# EAGLE design quanton rev.1 (EAGLE 6.4)

## Sheet 1 of 4
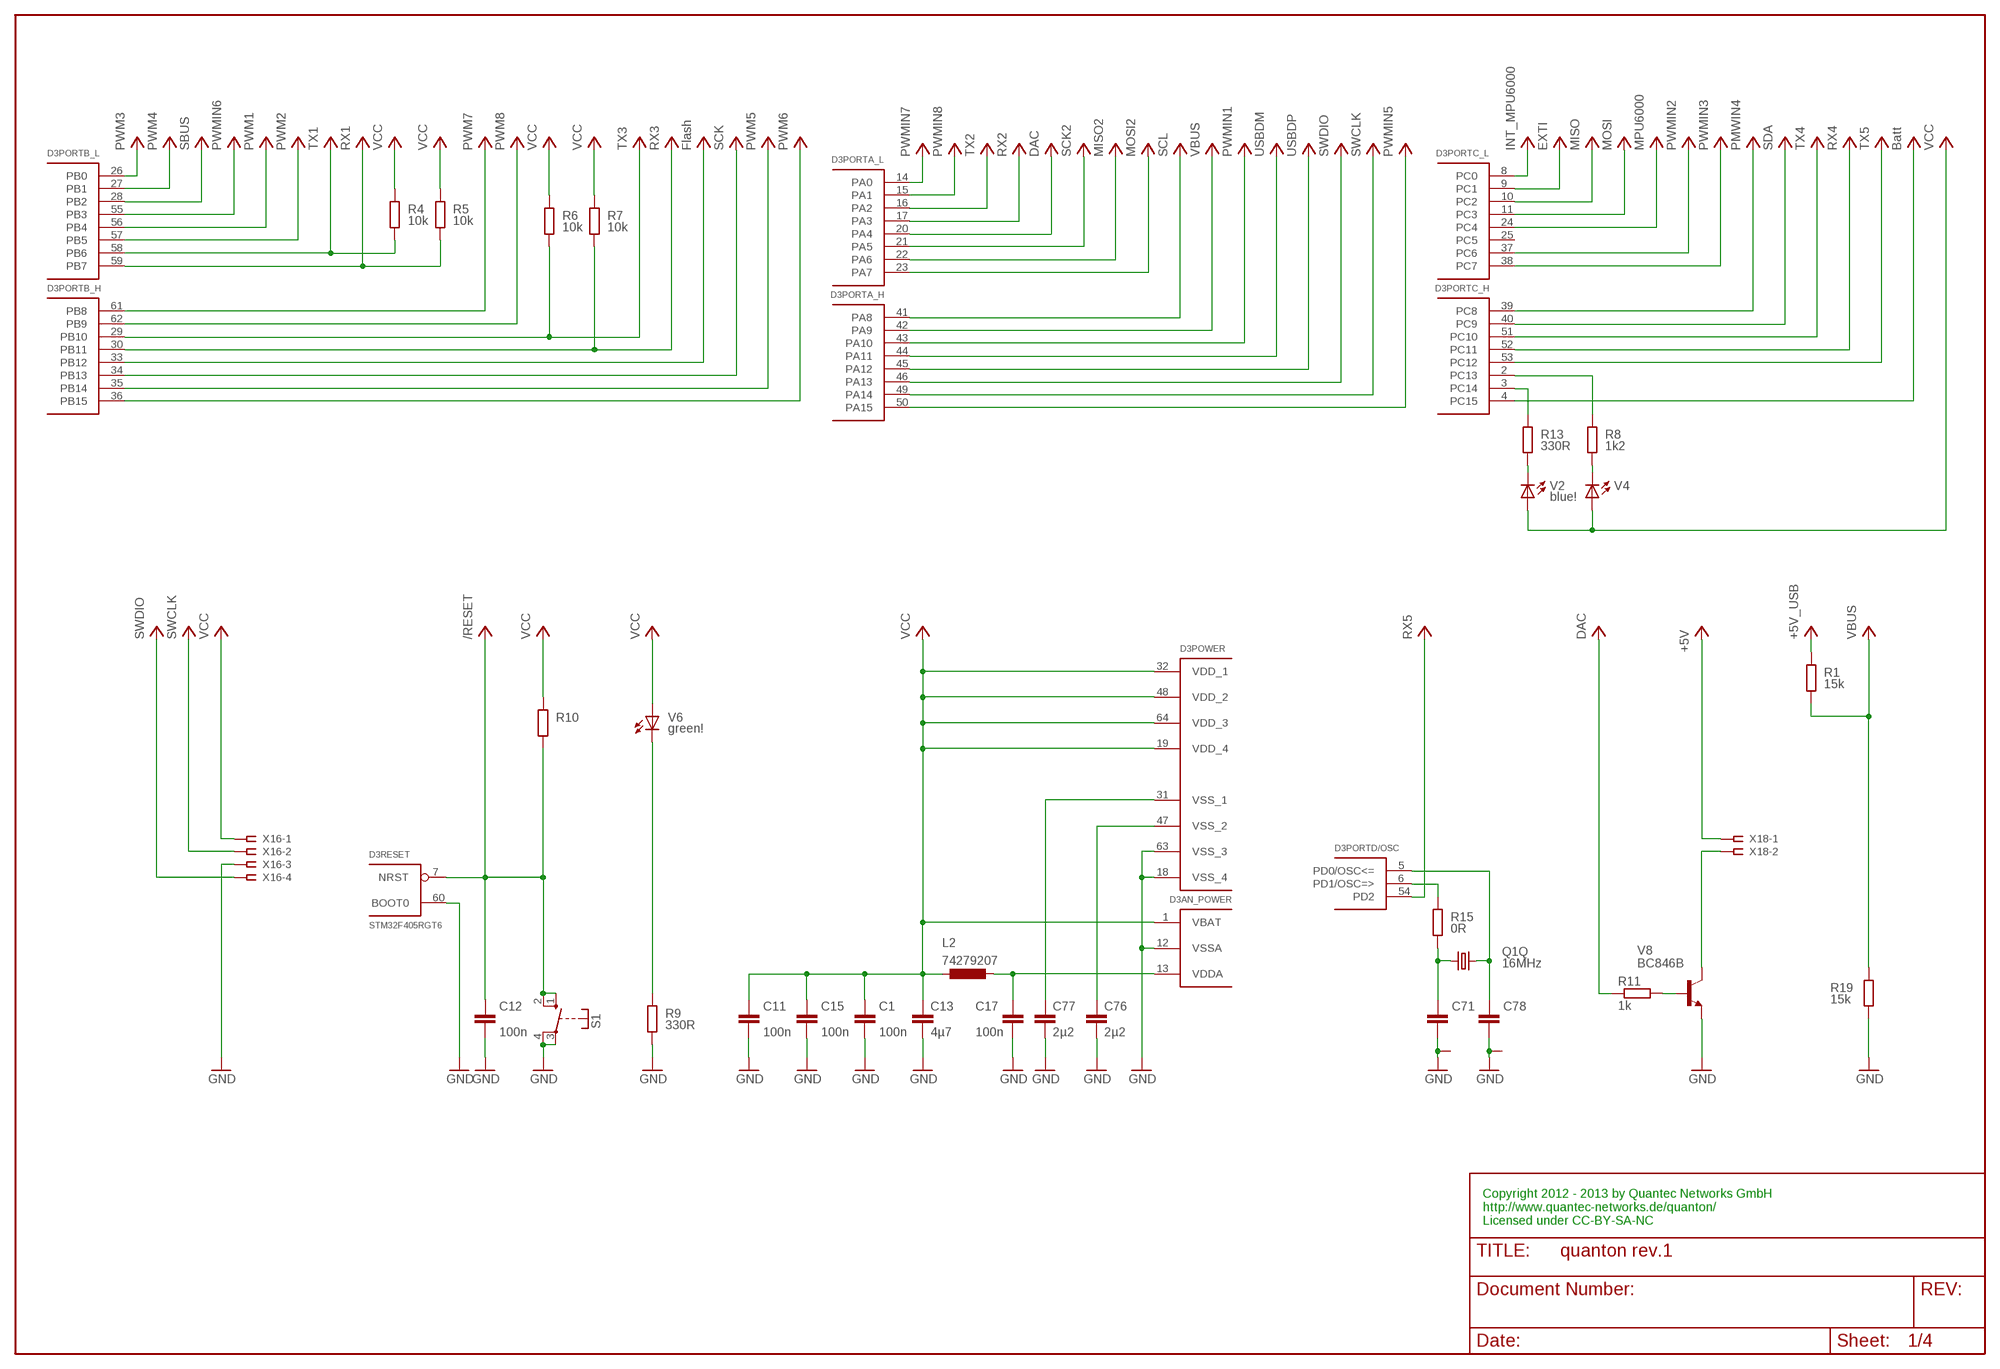
[diagram p0: schematic, sheet 1]

### Parts
C1  100n  C-EUC0402  [C0402]
C11  100n  C-EUC0402  [C0402]
C12  100n  C-EUC0402  [C0402]
C13  4µ7  C-EUC0805  [C0805]
C15  100n  C-EUC0402  [C0402]
C17  100n  C-EUC0402  [C0402]
C71  C-EUC0603  [C0603]
C76  2µ2  C-EUC0603  [C0603]
C77  2µ2  C-EUC0603  [C0603]
C78  C-EUC0603  [C0603]
D3  STM32F405RGT6  STM32F10XRXT6  [TQFP64]
L2  74279207  L-EU0805  [R0805]
Q1  16MHz  50X32  [50X32]
R1  15k  R-EU_R0603  [R0603]
R4  10k  R-EU_R0603  [R0603]
R5  10k  R-EU_R0603  [R0603]
R6  10k  R-EU_R0603  [R0603]
R7  10k  R-EU_R0603  [R0603]
R8  1k2  R-EU_R0603  [R0603]
R9  330R  R-EU_R0603  [R0603]
R10  R-EU_R0603  [R0603]
R11  1k  R-EU_R0603  [R0603]
R13  330R  R-EU_R0603  [R0603]
R15  0R  R-EU_R0603  [R0603]
R19  15k  R-EU_R0603  [R0603]
S1  KSCXXXX  [KSCXXXJ]
V2  blue!  LEDCHIP-LED0805  [CHIP-LED0805]
V4  red!  LEDCHIP-LED0805  [CHIP-LED0805]
V6  green!  LEDCHIP-LED0805  [CHIP-LED0805]
V8  BC846B  BC846BSMD  [SOT23]
X16  SSW-104-02-S-S  [SSW-104-02-S-S]
X18  SSW-101-02-S-D  [SSW-101-02-S-D]

### Nets
+5V: X18.1 ; also sheet 2,3
+5V_USB: R1.2 ; also sheet 3
/RESET: C12.1 D3.7(RESET:NRST) R10.1 S1.1(S) S1.2(S)
BATT: D3.4(PORTC_H:PC15) ; supply symbol labelled Batt ; also sheet 3
DAC: D3.20(PORTA_L:PA4) R11.1
EXTI: D3.9(PORTC_L:PC1) ; also sheet 4
FLASH: D3.33(PORTB_H:PB12) ; supply symbol labelled Flash ; also sheet 3
GND: C1.2 C11.2 C12.2 C13.2 C15.2 C17.2 C71.2 C76.2 C77.2 C78.2 D3.12(AN_POWER:VSSA) D3.18(POWER:VSS_4) D3.60(RESET:BOOT0) D3.63(POWER:VSS_3) Q1.2(GND1:GND) Q1.4(GND2:GND) R9.1 R19.1 S1.3(P) S1.4(P) V8.2(E) X16.3 ; also sheet 2,3,4
HL: C76.1 D3.47(POWER:VSS_2)
IIUPO: C77.1 D3.31(POWER:VSS_1)
INT_MPU6000: D3.8(PORTC_L:PC0) ; also sheet 3
MISO: D3.10(PORTC_L:PC2) ; also sheet 3
MISO2: D3.22(PORTA_L:PA6) ; also sheet 3
MOSI: D3.11(PORTC_L:PC3) ; also sheet 3
MOSI2: D3.23(PORTA_L:PA7) ; also sheet 3
MPU6000: D3.24(PORTC_L:PC4) ; also sheet 3
N$2: D3.3(PORTC_H:PC14) R13.2
N$3: C17.1 D3.13(AN_POWER:VDDA) L2.1
N$8: C78.1 D3.5(PORTD/OSC:PD0/OSC<=) Q1.3
N$11: R13.1 V2.C
N$20: R8.1 V4.C
N$21: D3.2(PORTC_H:PC13) R8.2
N$22: R9.2 V6.C
N$26: C71.1 Q1.1 R15.2
N$28: D3.6(PORTD/OSC:PD1/OSC=>) R15.1
N$44: V8.3(C) X18.2
N$45: R11.2 V8.1(B)
PMWIN4: D3.39(PORTC_H:PC8) ; also sheet 2
PWM1: D3.56(PORTB_L:PB4) ; also sheet 2
PWM2: D3.57(PORTB_L:PB5) ; also sheet 2
PWM3: D3.26(PORTB_L:PB0) ; also sheet 2
PWM4: D3.27(PORTB_L:PB1) ; also sheet 2
PWM5: D3.35(PORTB_H:PB14) ; also sheet 2
PWM6: D3.36(PORTB_H:PB15) ; also sheet 2
PWM7: D3.61(PORTB_H:PB8) ; also sheet 2
PWM8: D3.62(PORTB_H:PB9) ; also sheet 2
PWMIN1: D3.43(PORTA_H:PA10) ; also sheet 2
PWMIN2: D3.37(PORTC_L:PC6) ; also sheet 2
PWMIN3: D3.38(PORTC_L:PC7) ; also sheet 2
PWMIN5: D3.50(PORTA_H:PA15) ; also sheet 2
PWMIN6: D3.55(PORTB_L:PB3) ; also sheet 2
PWMIN7: D3.14(PORTA_L:PA0) ; also sheet 2
PWMIN8: D3.15(PORTA_L:PA1) ; also sheet 2
RX1: D3.59(PORTB_L:PB7) R5.1 ; also sheet 2
RX2: D3.17(PORTA_L:PA3) ; also sheet 2
RX3: D3.30(PORTB_H:PB11) R7.1 ; also sheet 2
RX4: D3.52(PORTC_H:PC11) ; also sheet 2
RX5: D3.54(PORTD/OSC:PD2) ; also sheet 2
SBUS: D3.28(PORTB_L:PB2) ; also sheet 2
SCK: D3.34(PORTB_H:PB13) ; also sheet 3
SCK2: D3.21(PORTA_L:PA5) ; also sheet 3
SCL: D3.41(PORTA_H:PA8) ; also sheet 4
SDA: D3.40(PORTC_H:PC9) ; also sheet 4
SWCLK: D3.49(PORTA_H:PA14) X16.2
SWDIO: D3.46(PORTA_H:PA13) X16.4
TX1: D3.58(PORTB_L:PB6) R4.1 ; also sheet 2
TX2: D3.16(PORTA_L:PA2) ; also sheet 2
TX3: D3.29(PORTB_H:PB10) R6.1 ; also sheet 2
TX4: D3.51(PORTC_H:PC10) ; also sheet 2
TX5: D3.53(PORTC_H:PC12) ; also sheet 2
USBDM: D3.44(PORTA_H:PA11) ; also sheet 3
USBDP: D3.45(PORTA_H:PA12) ; also sheet 3
VBUS: D3.42(PORTA_H:PA9) R1.1 R19.2
VCC: C1.1 C11.1 C13.1 C15.1 D3.1(AN_POWER:VBAT) D3.19(POWER:VDD_4) D3.32(POWER:VDD_1) D3.48(POWER:VDD_2) D3.64(POWER:VDD_3) L2.2 R4.2 R5.2 R6.2 R7.2 R10.2 V2.A V4.A V6.A X16.1 ; also sheet 2,3,4
Unconnected: D3.25(PORTC_L:PC5)

### Notes on the sheet
- Copyright 2012 - 2013 by Quantec Networks GmbH
  http://www.quantec-networks.de/quanton/
  Licensed under CC-BY-SA-NC

## Sheet 2 of 4
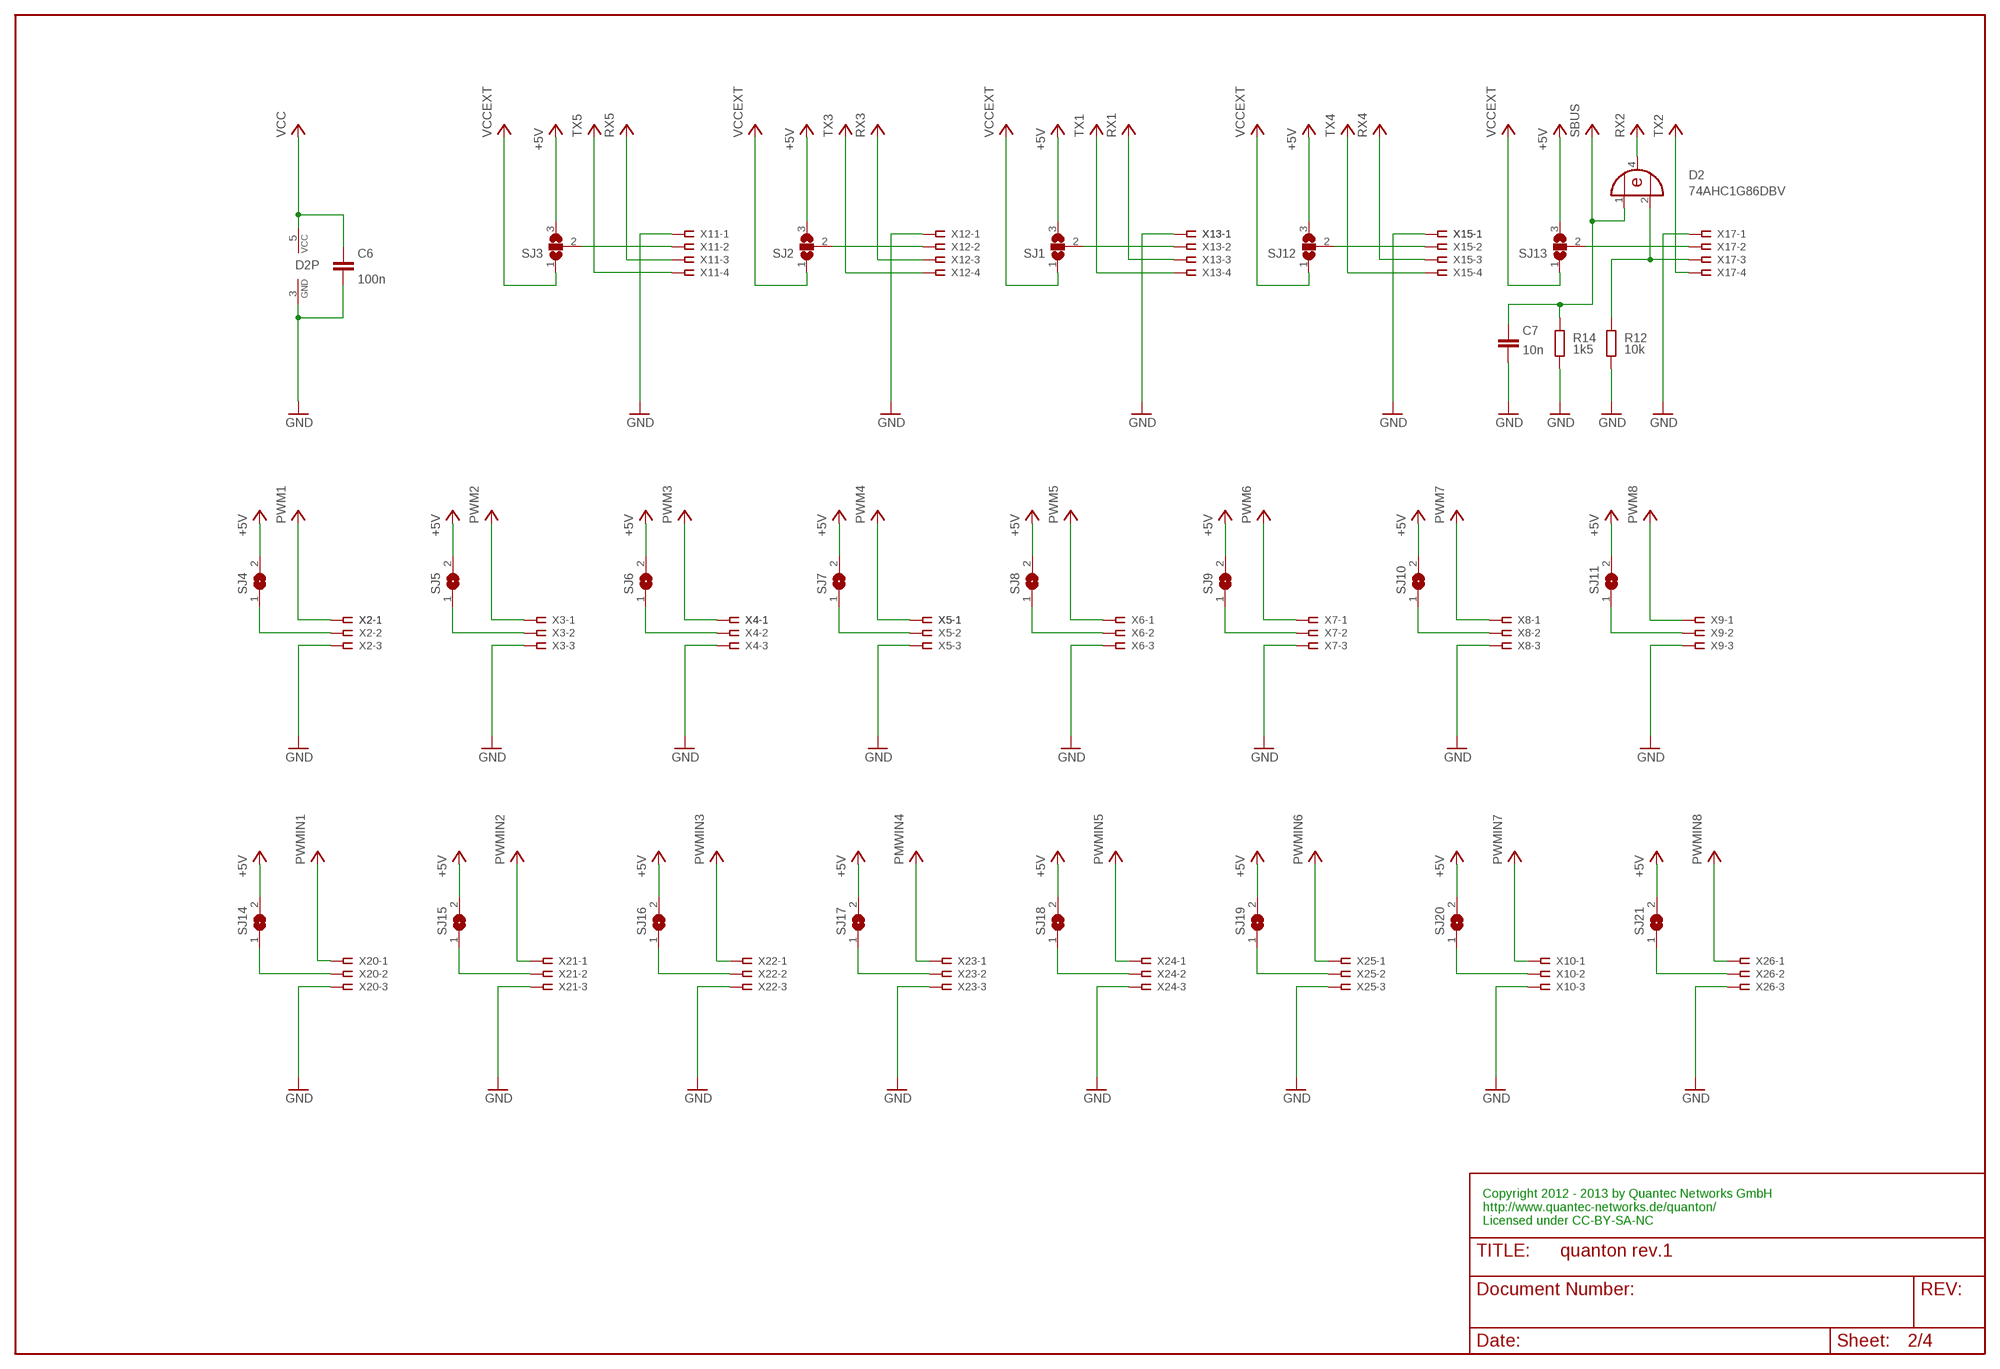
[diagram p1: schematic, sheet 2]

### Parts
C6  100n  C-EUC0402  [C0402]
C7  10n  C-EUC0603  [C0603]
D2  74AHC1G86DBV  [SOT23-5]
R12  10k  R-EU_R0603  [R0603]
R14  1k5  R-EU_R0603  [R0603]
SJ1  SJ2W  [SJ_2]
SJ2  SJ2W  [SJ_2]
SJ3  SJ2W  [SJ_2]
SJ4  SJ  [SJ]
SJ5  SJ  [SJ]
SJ6  SJ  [SJ]
SJ7  SJ  [SJ]
SJ8  SJ  [SJ]
SJ9  SJ  [SJ]
SJ10  SJ  [SJ]
SJ11  SJ  [SJ]
SJ12  SJ2W  [SJ_2]
SJ13  SJ2W  [SJ_2]
SJ14  SJ  [SJ]
SJ15  SJ  [SJ]
SJ16  SJ  [SJ]
SJ17  SJ  [SJ]
SJ18  SJ  [SJ]
SJ19  SJ  [SJ]
SJ20  SJ  [SJ]
SJ21  SJ  [SJ]
X2  SSW-101-02-S-T  [SSW-101-02-S-T]
X3  SSW-101-02-S-T  [SSW-101-02-S-T]
X4  SSW-101-02-S-T  [SSW-101-02-S-T]
X5  SSW-101-02-S-T  [SSW-101-02-S-T]
X6  SSW-101-02-S-T  [SSW-101-02-S-T]
X7  SSW-101-02-S-T  [SSW-101-02-S-T]
X8  SSW-101-02-S-T  [SSW-101-02-S-T]
X9  SSW-101-02-S-T  [SSW-101-02-S-T]
X10  SSW-101-02-S-T  [SSW-101-02-S-T]
X11  SSW-104-02-S-S  [SSW-104-02-S-S]
X12  SSW-104-02-S-S  [SSW-104-02-S-S]
X13  SSW-104-02-S-S  [SSW-104-02-S-S]
X15  SSW-104-02-S-S  [SSW-104-02-S-S]
X17  SSW-104-02-S-S  [SSW-104-02-S-S]
X20  SSW-101-02-S-T  [SSW-101-02-S-T]
X21  SSW-101-02-S-T  [SSW-101-02-S-T]
X22  SSW-101-02-S-T  [SSW-101-02-S-T]
X23  SSW-101-02-S-T  [SSW-101-02-S-T]
X24  SSW-101-02-S-T  [SSW-101-02-S-T]
X25  SSW-101-02-S-T  [SSW-101-02-S-T]
X26  SSW-101-02-S-T  [SSW-101-02-S-T]

### Nets
+5V: SJ1.3 SJ2.3 SJ3.3 SJ4.2 SJ5.2 SJ6.2 SJ7.2 SJ8.2 SJ9.2 SJ10.2 SJ11.2 SJ12.3 SJ13.3 SJ14.2 SJ15.2 SJ16.2 SJ17.2 SJ18.2 SJ19.2 SJ20.2 SJ21.2 ; also sheet 1,3
GND: C6.2 C7.2 D2.3(GND) R12.1 R14.1 X2.3 X3.3 X4.3 X5.3 X6.3 X7.3 X8.3 X9.3 X10.3 X11.1 X12.1 X13.1 X15.1 X17.1 X20.3 X21.3 X22.3 X23.3 X24.3 X25.3 X26.3 ; also sheet 1,3,4
N$1: SJ1.2 X13.2
N$5: SJ4.1 X2.2
N$6: SJ2.2 X12.2
N$7: SJ3.2 X11.2
N$9: SJ5.1 X3.2
N$10: SJ6.1 X4.2
N$12: SJ7.1 X5.2
N$13: SJ8.1 X6.2
N$14: SJ9.1 X7.2
N$15: SJ10.1 X8.2
N$16: SJ11.1 X9.2
N$23: SJ12.2 X15.2
N$24: SJ13.2 X17.2
N$25: D2.2(I1) R12.2 X17.3
N$29: SJ14.1 X20.2
N$30: SJ15.1 X21.2
N$31: SJ16.1 X22.2
N$32: SJ17.1 X23.2
N$33: SJ18.1 X24.2
N$34: SJ19.1 X25.2
N$35: SJ20.1 X10.2
N$36: SJ21.1 X26.2
PMWIN4: X23.1 ; also sheet 1
PWM1: X2.1 ; also sheet 1
PWM2: X3.1 ; also sheet 1
PWM3: X4.1 ; also sheet 1
PWM4: X5.1 ; also sheet 1
PWM5: X6.1 ; also sheet 1
PWM6: X7.1 ; also sheet 1
PWM7: X8.1 ; also sheet 1
PWM8: X9.1 ; also sheet 1
PWMIN1: X20.1 ; also sheet 1
PWMIN2: X21.1 ; also sheet 1
PWMIN3: X22.1 ; also sheet 1
PWMIN5: X24.1 ; also sheet 1
PWMIN6: X25.1 ; also sheet 1
PWMIN7: X10.1 ; also sheet 1
PWMIN8: X26.1 ; also sheet 1
RX1: X13.3 ; also sheet 1
RX2: D2.4(O) ; also sheet 1
RX3: X12.3 ; also sheet 1
RX4: X15.3 ; also sheet 1
RX5: X11.3 ; also sheet 1
SBUS: C7.1 D2.1(I0) R14.2 ; also sheet 1
TX1: X13.4 ; also sheet 1
TX2: X17.4 ; also sheet 1
TX3: X12.4 ; also sheet 1
TX4: X15.4 ; also sheet 1
TX5: X11.4 ; also sheet 1
VCC: C6.1 D2.5(VCC) ; also sheet 1,3,4
VCCEXT: SJ1.1 SJ2.1 SJ3.1 SJ12.1 SJ13.1 ; also sheet 3

### Notes on the sheet
- Copyright 2012 - 2013 by Quantec Networks GmbH
  http://www.quantec-networks.de/quanton/
  Licensed under CC-BY-SA-NC

## Sheet 3 of 4
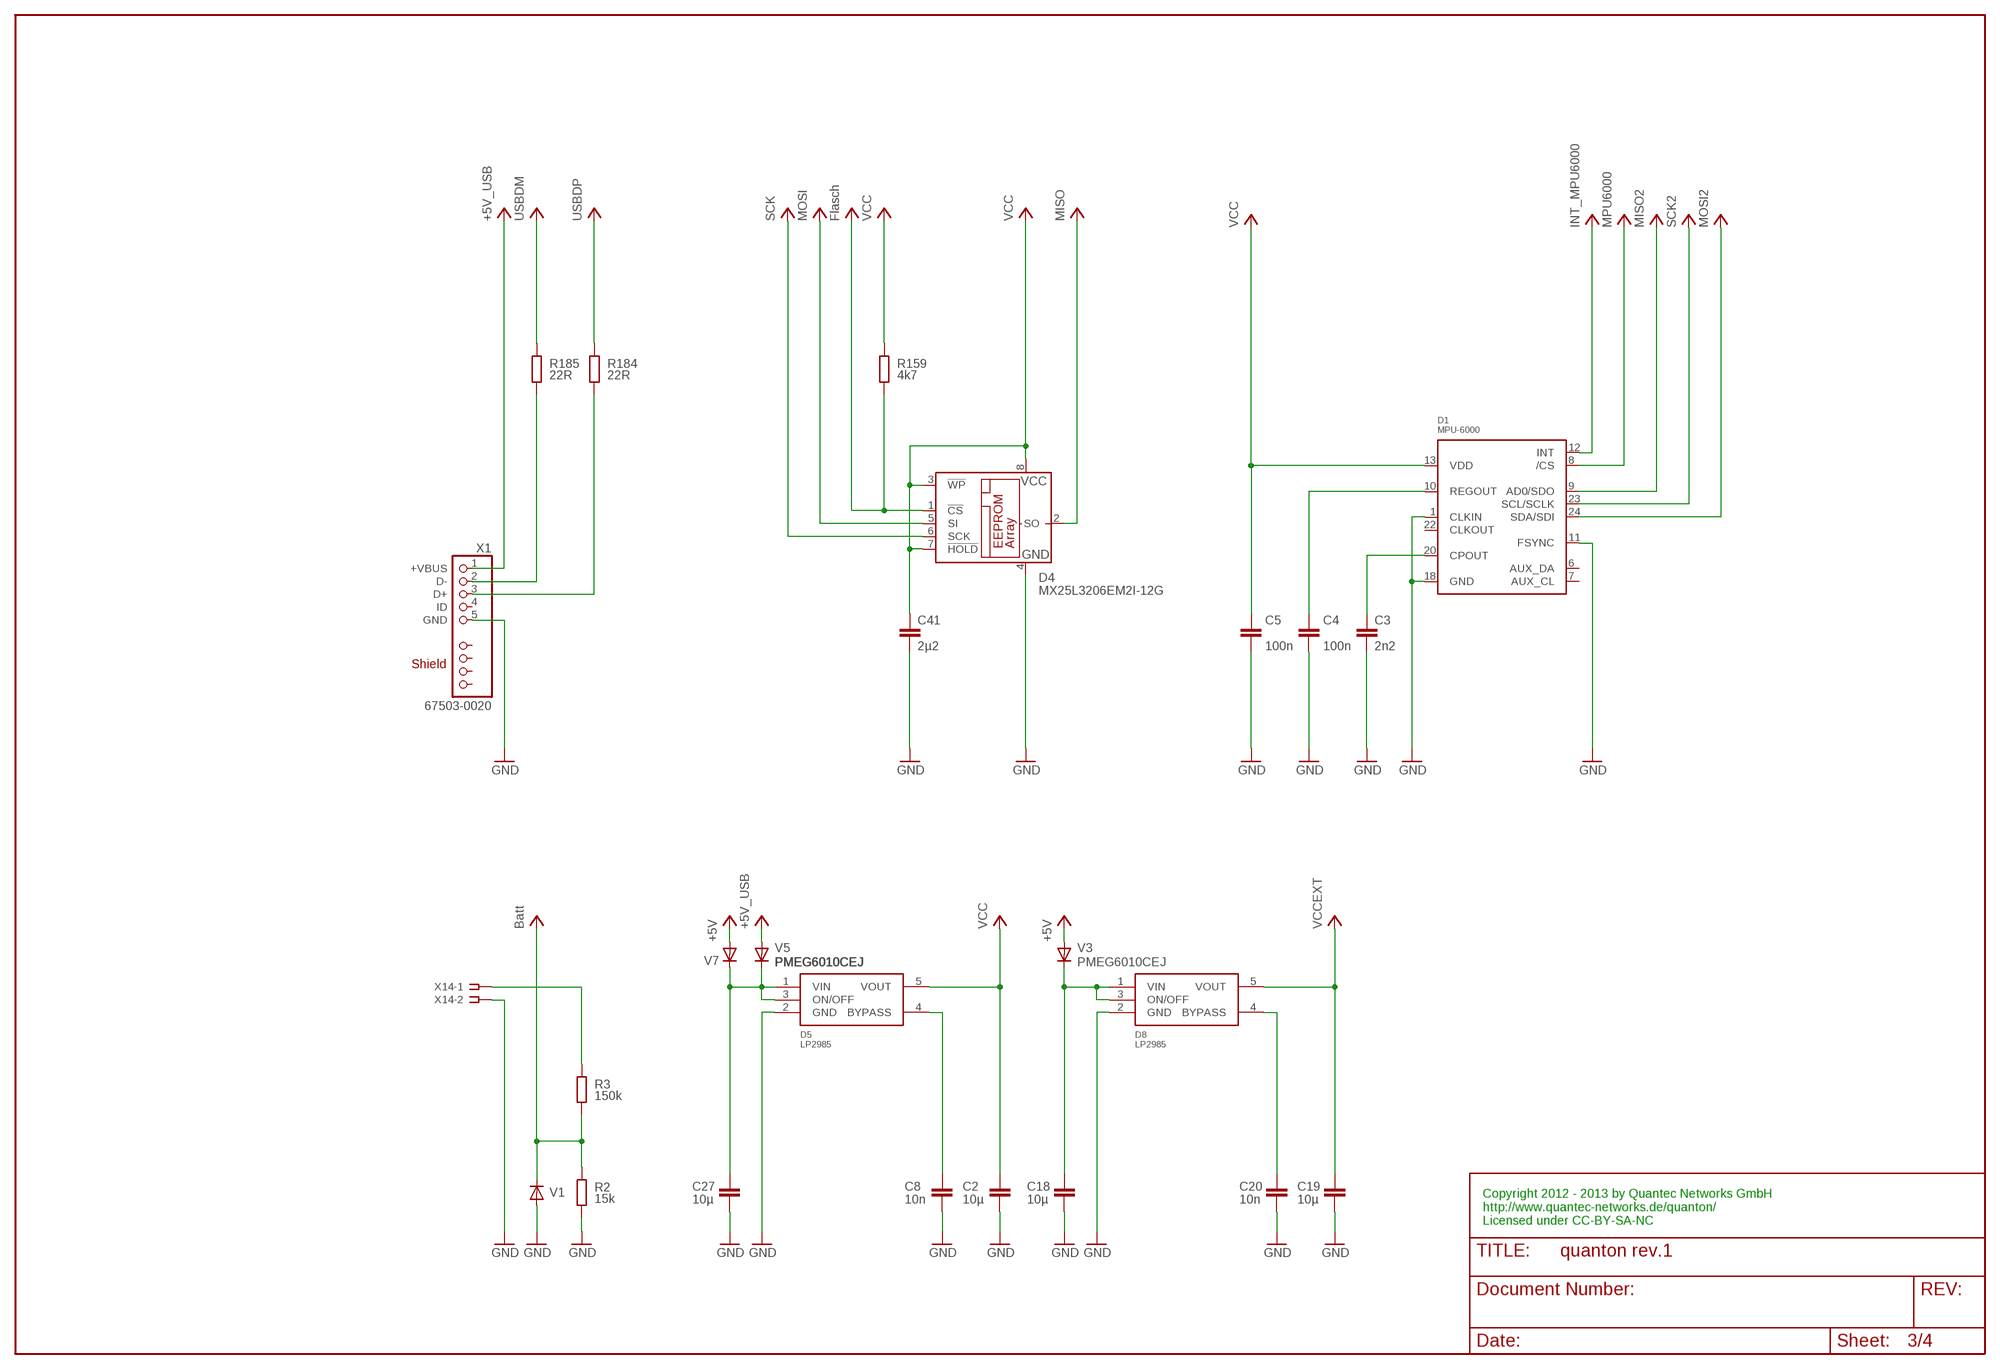
[diagram p2: schematic, sheet 3]

### Parts
C2  10µ  C-EUC0805  [C0805]
C3  2n2  C-EUC0603  [C0603]
C4  100n  C-EUC0402  [C0402]
C5  100n  C-EUC0402  [C0402]
C8  10n  C-EUC0603  [C0603]
C18  10µ  C-EUC0805  [C0805]
C19  10µ  C-EUC0805  [C0805]
C20  10n  C-EUC0603  [C0603]
C27  10µ  C-EUC0805  [C0805]
C41  2µ2  C-EUC0603  [C0603]
D1  MPU-6000  [QFN24-4X4]
D4  MX25L3206EM2I-12G  AT26DF081A-SU  [SOIC8]
D5  LP2985  [SOT23-5]
D8  LP2985  [SOT23-5]
R2  15k  R-EU_R0603  [R0603]
R3  150k  R-EU_R0603  [R0603]
R159  4k7  R-EU_R0603  [R0603]
R184  22R  R-EU_R0402  [R0402]
R185  22R  R-EU_R0402  [R0402]
V1  PMEG6010CEJ  DIODE-SOD323-R  [SOD323-R]
V3  PMEG6010CEJ  DIODE-SOD323-R  [SOD323-R]
V5  PMEG6010CEJ  DIODE-SOD323-R  [SOD323-R]
V7  PMEG6010CEJ  DIODE-SOD323-R  [SOD323-R]
X1  67503-0020  [67503-0020]
X14  SSW-101-02-S-D  [SSW-101-02-S-D]

### Nets
+5V: V3.A V7.A ; also sheet 1,2
+5V_USB: V5.A X1.1(+VBUS) ; also sheet 1
+24V+USB: C27.1 D5.1(VIN) D5.3(ON/OFF) V5.C V7.C
BATT: R2.2 R3.1 V1.C ; supply symbol labelled Batt ; also sheet 1
FLASH: D4.1(!CS) R159.1 ; supply symbol labelled Flasch ; also sheet 1
GND: C2.2 C3.2 C4.2 C5.2 C8.2 C18.2 C19.2 C20.2 C27.2 C41.2 D1.1(CLKIN) D1.11(FSYNC) D1.18(GND) D4.4(GND) D5.2(GND) D8.2(GND) R2.1 V1.A X1.5(GND) X14.2 ; also sheet 1,2,4
INT_MPU6000: D1.12(INT) ; also sheet 1
MISO: D4.2(SO) ; also sheet 1
MISO2: D1.9(AD0/SDO) ; also sheet 1
MOSI: D4.5(SI) ; also sheet 1
MOSI2: D1.24(SDA/SDI) ; also sheet 1
MPU6000: D1.8(/CS) ; also sheet 1
N$4: C18.1 D8.1(VIN) D8.3(ON/OFF) V3.C
N$17: R3.2 X14.1
N$18: C3.1 D1.20(CPOUT)
N$19: C4.1 D1.10(REGOUT)
N$27: C8.1 D5.4(BYPASS)
N$40: C20.1 D8.4(BYPASS)
N$228: R185.1 X1.2(D-)
N$229: R184.1 X1.3(D+)
SCK: D4.6(SCK) ; also sheet 1
SCK2: D1.23(SCL/SCLK) ; also sheet 1
USBDM: R185.2 ; also sheet 1
USBDP: R184.2 ; also sheet 1
VCC: C2.1 C5.1 C41.1 D1.13(VDD) D4.3(!WP) D4.7(!HOLD) D4.8(VCC) D5.5(VOUT) R159.2 ; also sheet 1,2,4
VCCEXT: C19.1 D8.5(VOUT) ; also sheet 2
Unconnected: D1.6(AUX_DA) D1.7(AUX_CL) D1.22(CLKOUT) X1.4(ID) X1.P$1 X1.P$2 X1.P$3 X1.P$4

### Notes on the sheet
- Copyright 2012 - 2013 by Quantec Networks GmbH
  http://www.quantec-networks.de/quanton/
  Licensed under CC-BY-SA-NC

## Sheet 4 of 4
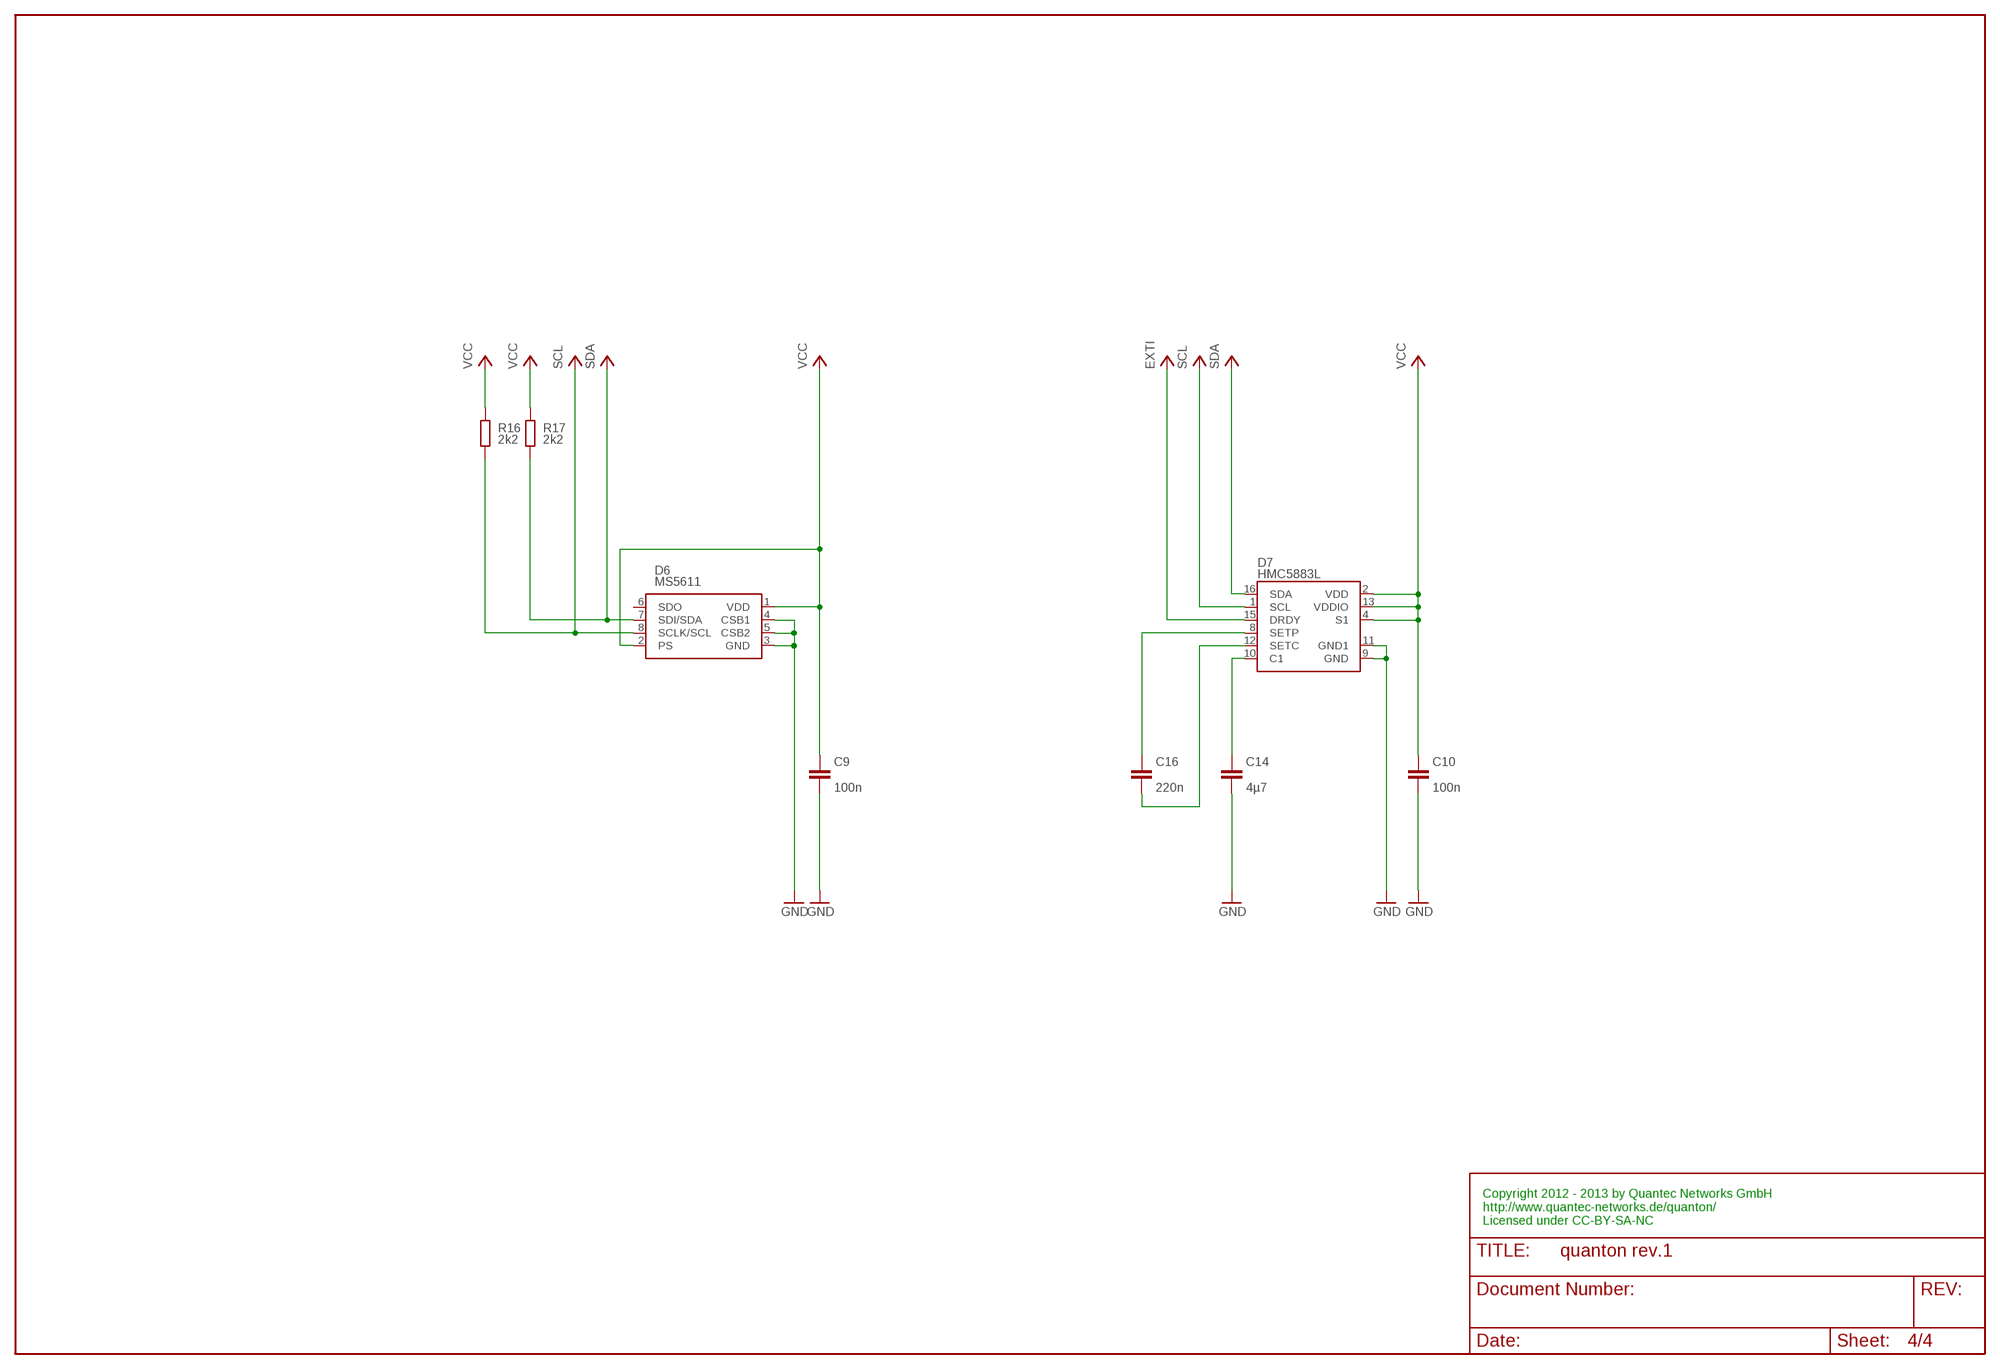
[diagram p3: schematic, sheet 4]

### Parts
C9  100n  C-EUC0402  [C0402]
C10  100n  C-EUC0402  [C0402]
C14  4µ7  C-EUC0805  [C0805]
C16  220n  C-EUC0603  [C0603]
D6  MS5611  [QFN8-5X3]
D7  HMC5883L  [LCC16-3X3]
R16  2k2  R-EU_R0603  [R0603]
R17  2k2  R-EU_R0603  [R0603]

### Nets
EXTI: D7.15(DRDY) ; also sheet 1
GND: C9.2 C10.2 C14.2 D6.3(GND) D6.4(CSB1) D6.5(CSB2) D7.9(GND) D7.11(GND1) ; also sheet 1,2,3
N$37: C14.1 D7.10(C1)
N$38: C16.1 D7.8(SETP)
N$39: C16.2 D7.12(SETC)
SCL: D6.8(SCLK/SCL) D7.1(SCL) R16.1 ; also sheet 1
SDA: D6.7(SDI/SDA) D7.16(SDA) R17.1 ; also sheet 1
VCC: C9.1 C10.1 D6.1(VDD) D6.2(PS) D7.2(VDD) D7.4(S1) D7.13(VDDIO) R16.2 R17.2 ; also sheet 1,2,3
Unconnected: D6.6(SDO)

### Notes on the sheet
- Copyright 2012 - 2013 by Quantec Networks GmbH
  http://www.quantec-networks.de/quanton/
  Licensed under CC-BY-SA-NC

## Library data of the parts
C1 C4-C6 C9-C12 C15 C17 = rcl:C-EU: CAPACITOR, European symbol; ABAS: 11193
C2 C18 C19 C27 = rcl:C-EU: CAPACITOR, European symbol; ABAS: 11236
C3 = rcl:C-EU: CAPACITOR, European symbol; ABAS: 12513
C7 C8 C20 = rcl:C-EU: CAPACITOR, European symbol; ABAS: 11192
C13 C14 = rcl:C-EU: CAPACITOR, European symbol; ABAS: 11194
C16 = rcl:C-EU: CAPACITOR, European symbol; ABAS: 12114
C41 C76 C77 = rcl:C-EU: CAPACITOR, European symbol; ABAS: 11195
C71 C78 = rcl:C-EU: CAPACITOR, European symbol; ABAS: -1
D1 = invensense:MPU-6000; ABAS: 12533
D2 = 74xx-little-de:74*1G86: 2-input EXCLUSIV-OR gate; ABAS: 12532
D3 = stm32:STM32F10XRXT6: STM32F101/103 64pin LQFP; ABAS: 12531
D4 = atmel:AT26DF081A-SU; ABAS: 12622
D5 D8 = texas:LP2985; ABAS: 12636
D6 = intersema:MS5611; ABAS: 12637
D7 = honeywell:HMC5883L; ABAS: 12638
L2 = rcl:L-EU: INDUCTOR, European symbol; ABAS: 11200
Q1 = crystal:50X32; ABAS: 12620
R1 R2 R19 = rcl:R-EU_: RESISTOR, European symbol; ABAS: 12527
R3 = rcl:R-EU_: RESISTOR, European symbol; ABAS: 11359
R4-R7 R12 = rcl:R-EU_: RESISTOR, European symbol; ABAS: 11181
R8 = rcl:R-EU_: RESISTOR, European symbol; ABAS: 11182
R9 R13 = rcl:R-EU_: RESISTOR, European symbol; ABAS: 11711
R10 = rcl:R-EU_: RESISTOR, European symbol; ABAS: -1
R11 = rcl:R-EU_: RESISTOR, European symbol; ABAS: 11177
R14 = rcl:R-EU_: RESISTOR, European symbol; ABAS: 11180
R15 = rcl:R-EU_: RESISTOR, European symbol; ABAS: 11183
R16 R17 = rcl:R-EU_: RESISTOR, European symbol; ABAS: 11699
R159 = rcl:R-EU_: RESISTOR, European symbol; ABAS: 11301
R184 R185 = rcl:R-EU_: RESISTOR, European symbol; ABAS: 11308
S1 = switch-misc:KSCXXXX; ABAS: 12536
SJ1-SJ3 SJ12 SJ13 = jumper:SJ2W: SMD solder JUMPER; ABAS: -1
SJ4-SJ11 SJ14-SJ21 = jumper:SJ: SMD solder JUMPER; ABAS: -1
V1 V3 V5 V7 = diode:DIODE-: DIODE; ABAS: 11939
V2 = led:LED: LED OSRAM: - CHIPLED LG R971, LG N971, LY N971, LG Q971, LY Q971, LO R971, LY R971 LH N974, LH R974 LS Q976, LO Q976, LY Q976 LO Q996 - Hyper CHIPLED LW Q18S LB Q993, LB Q99A, LB R99A - SideLED LS A670, LO A670, LY A670, LG A670, LP A670 LB A673, LV A673, LT A673, LW A673 LH A674 LY A675 LS A676, LA A676, LO A676, LY A676, LW A676 LS A679, LY A679, LG A679 - Hyper Micro SIDELED® LS Y876, LA Y876, LO Y876, LY Y876 LT Y87S - SmartLED LW L88C, LW L88S LB L89C, LB L89S, LG L890 LS L89K, LO L89K, LY L89K LS L896, LA L896, LO L896, LY L896 - TOPLED LS T670, LO T670, LY T670, LG T670, LP T670 LSG T670, LSP T670, LSY T670, LOP T670, LYG T670 LG T671, LOG T671, LSG T671 LB T673, LV T673, LT T673, LW T673 LH T674 LS T676, LA T676, LO T676, LY T676, LB T676, LH T676, LSB T676, LW T676 LB T67C, LV T67C, LT T67C, LS T67K, LO T67K, LY T67K, LW E67C LS E67B, LA E67B, LO E67B, LY E67B, LB E67C, LV E67C, LT E67C LW T67C LS T679, LY T679, LG T679 LS T770, LO T770, LY T770, LG T770, LP T770 LB T773, LV T773, LT T773, LW T773 LH T774 LS E675, LA E675, LY E675, LS T675 LS T776, LA T776, LO T776, LY T776, LB T776 LHGB T686 LT T68C, LB T68C - Hyper Mini TOPLED® LB M676 - Mini TOPLED Santana® LG M470 LS M47K, LO M47K, LY M47K Source: http://www.osram.convergy.de/; ABAS: 11213
V4 = led:LED: LED OSRAM: - CHIPLED LG R971, LG N971, LY N971, LG Q971, LY Q971, LO R971, LY R971 LH N974, LH R974 LS Q976, LO Q976, LY Q976 LO Q996 - Hyper CHIPLED LW Q18S LB Q993, LB Q99A, LB R99A - SideLED LS A670, LO A670, LY A670, LG A670, LP A670 LB A673, LV A673, LT A673, LW A673 LH A674 LY A675 LS A676, LA A676, LO A676, LY A676, LW A676 LS A679, LY A679, LG A679 - Hyper Micro SIDELED® LS Y876, LA Y876, LO Y876, LY Y876 LT Y87S - SmartLED LW L88C, LW L88S LB L89C, LB L89S, LG L890 LS L89K, LO L89K, LY L89K LS L896, LA L896, LO L896, LY L896 - TOPLED LS T670, LO T670, LY T670, LG T670, LP T670 LSG T670, LSP T670, LSY T670, LOP T670, LYG T670 LG T671, LOG T671, LSG T671 LB T673, LV T673, LT T673, LW T673 LH T674 LS T676, LA T676, LO T676, LY T676, LB T676, LH T676, LSB T676, LW T676 LB T67C, LV T67C, LT T67C, LS T67K, LO T67K, LY T67K, LW E67C LS E67B, LA E67B, LO E67B, LY E67B, LB E67C, LV E67C, LT E67C LW T67C LS T679, LY T679, LG T679 LS T770, LO T770, LY T770, LG T770, LP T770 LB T773, LV T773, LT T773, LW T773 LH T774 LS E675, LA E675, LY E675, LS T675 LS T776, LA T776, LO T776, LY T776, LB T776 LHGB T686 LT T68C, LB T68C - Hyper Mini TOPLED® LB M676 - Mini TOPLED Santana® LG M470 LS M47K, LO M47K, LY M47K Source: http://www.osram.convergy.de/; ABAS: 11214
V6 = led:LED: LED OSRAM: - CHIPLED LG R971, LG N971, LY N971, LG Q971, LY Q971, LO R971, LY R971 LH N974, LH R974 LS Q976, LO Q976, LY Q976 LO Q996 - Hyper CHIPLED LW Q18S LB Q993, LB Q99A, LB R99A - SideLED LS A670, LO A670, LY A670, LG A670, LP A670 LB A673, LV A673, LT A673, LW A673 LH A674 LY A675 LS A676, LA A676, LO A676, LY A676, LW A676 LS A679, LY A679, LG A679 - Hyper Micro SIDELED® LS Y876, LA Y876, LO Y876, LY Y876 LT Y87S - SmartLED LW L88C, LW L88S LB L89C, LB L89S, LG L890 LS L89K, LO L89K, LY L89K LS L896, LA L896, LO L896, LY L896 - TOPLED LS T670, LO T670, LY T670, LG T670, LP T670 LSG T670, LSP T670, LSY T670, LOP T670, LYG T670 LG T671, LOG T671, LSG T671 LB T673, LV T673, LT T673, LW T673 LH T674 LS T676, LA T676, LO T676, LY T676, LB T676, LH T676, LSB T676, LW T676 LB T67C, LV T67C, LT T67C, LS T67K, LO T67K, LY T67K, LW E67C LS E67B, LA E67B, LO E67B, LY E67B, LB E67C, LV E67C, LT E67C LW T67C LS T679, LY T679, LG T679 LS T770, LO T770, LY T770, LG T770, LP T770 LB T773, LV T773, LT T773, LW T773 LH T774 LS E675, LA E675, LY E675, LS T675 LS T776, LA T776, LO T776, LY T776, LB T776 LHGB T686 LT T68C, LB T68C - Hyper Mini TOPLED® LB M676 - Mini TOPLED Santana® LG M470 LS M47K, LO M47K, LY M47K Source: http://www.osram.convergy.de/; ABAS: 11215
V8 = transistor-npn:BC846*: NPN Transistor; ABAS: 11291
X1 = con-molex:67503-0020; ABAS: 11701
X2-X10 X20-X26 = con-samtec:SSW-101-02-S-T: THROUGH-HOLE .025" SQ POST SOCKET Source: Samtec SSW.pdf; ABAS: -1; MPN: SSW-101-02-S-T; OC_FARNELL: unknown; OC_NEWARK: 82P1460
X11-X13 X15-X17 = con-samtec:SSW-104-02-S-S: THROUGH-HOLE .025" SQ POST SOCKET Source: Samtec SSW.pdf; ABAS: -1; MPN: SSW-104-02-S-S; OC_FARNELL: unknown; OC_NEWARK: 11P9384
X14 X18 = con-samtec:SSW-101-02-S-D: THROUGH-HOLE .025" SQ POST SOCKET Source: Samtec SSW.pdf; ABAS: -1; MPN: SSW-101-02-S-D; OC_FARNELL: unknown; OC_NEWARK: 82P1456

## Net classes
1 +5v: width 0.406 mm
2 vbat: width 0.813 mm

## Board
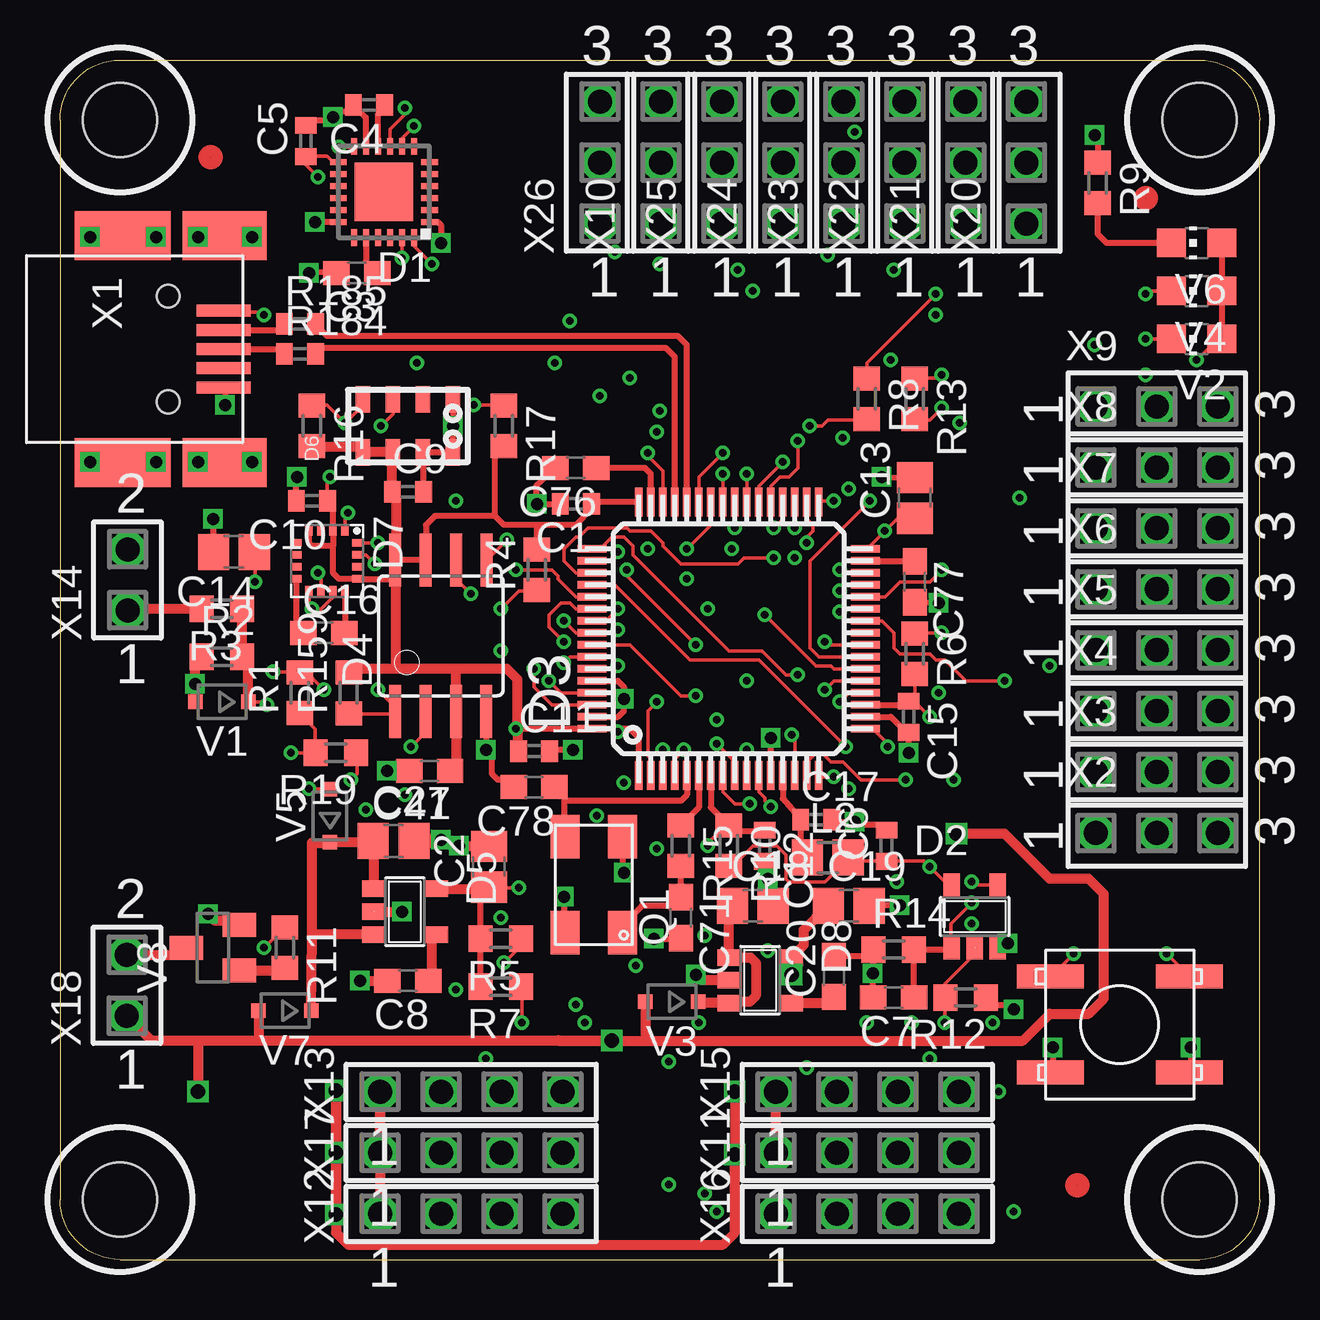
[diagram p4: board, top side]
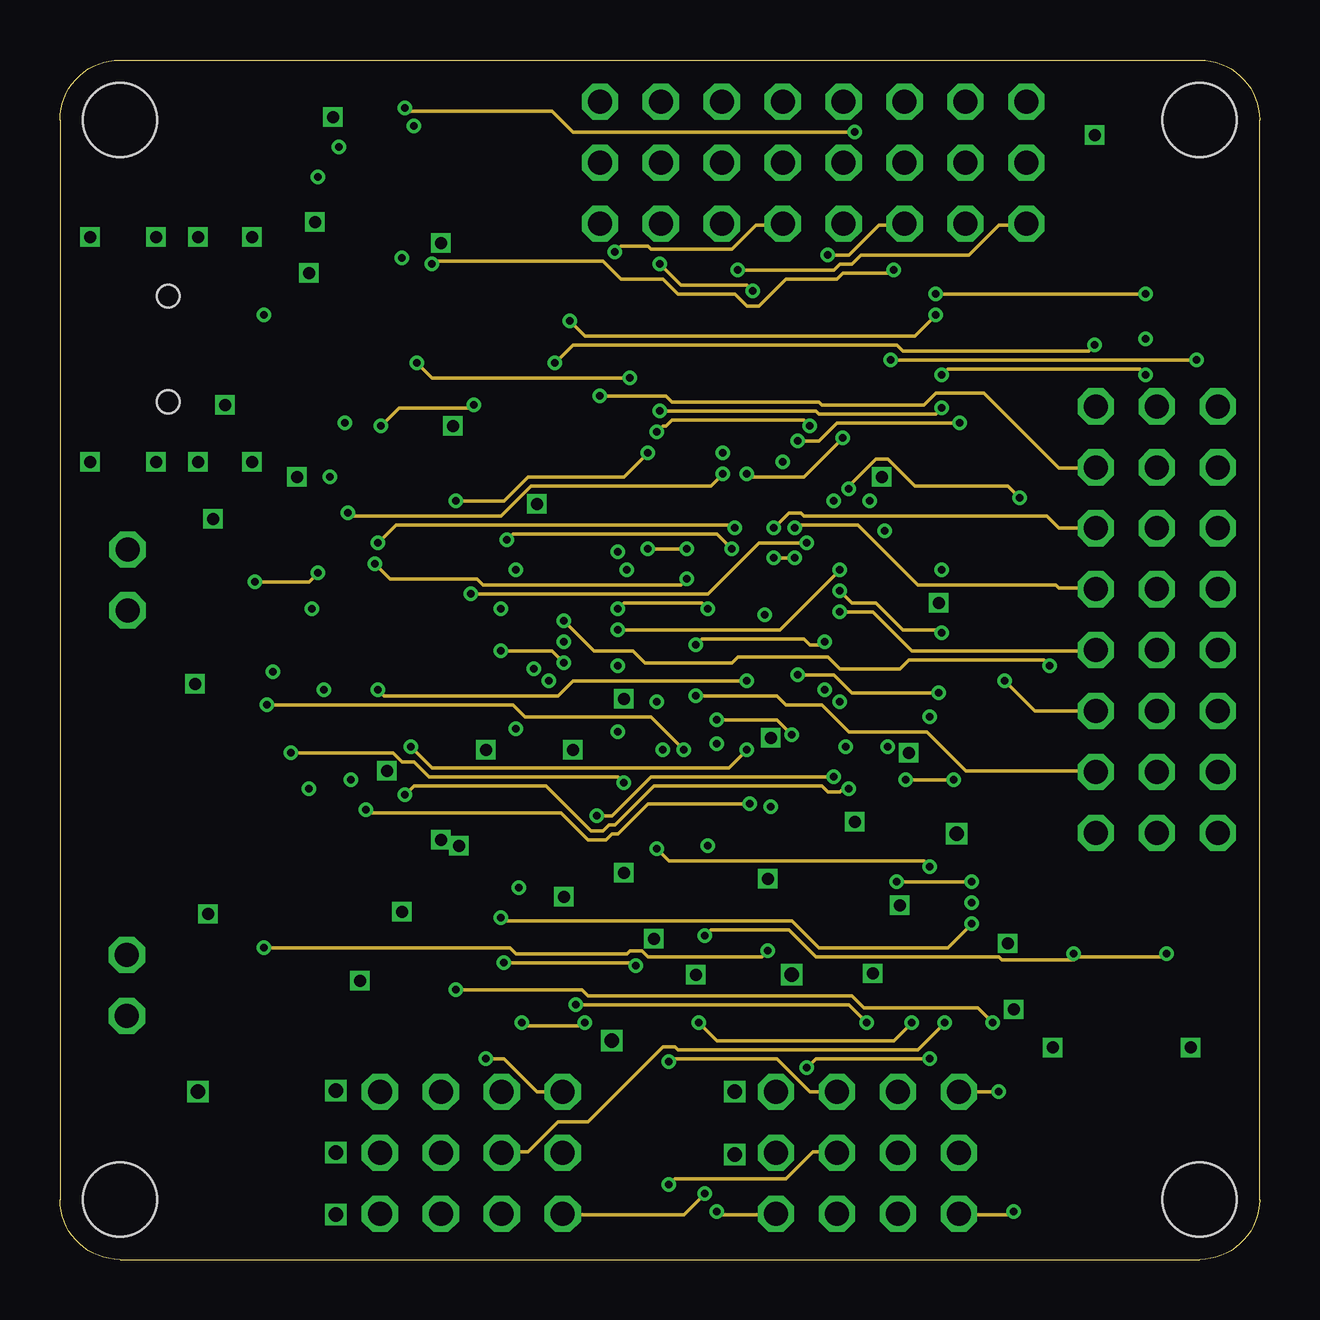
[diagram p5: board, inner layer Route2]
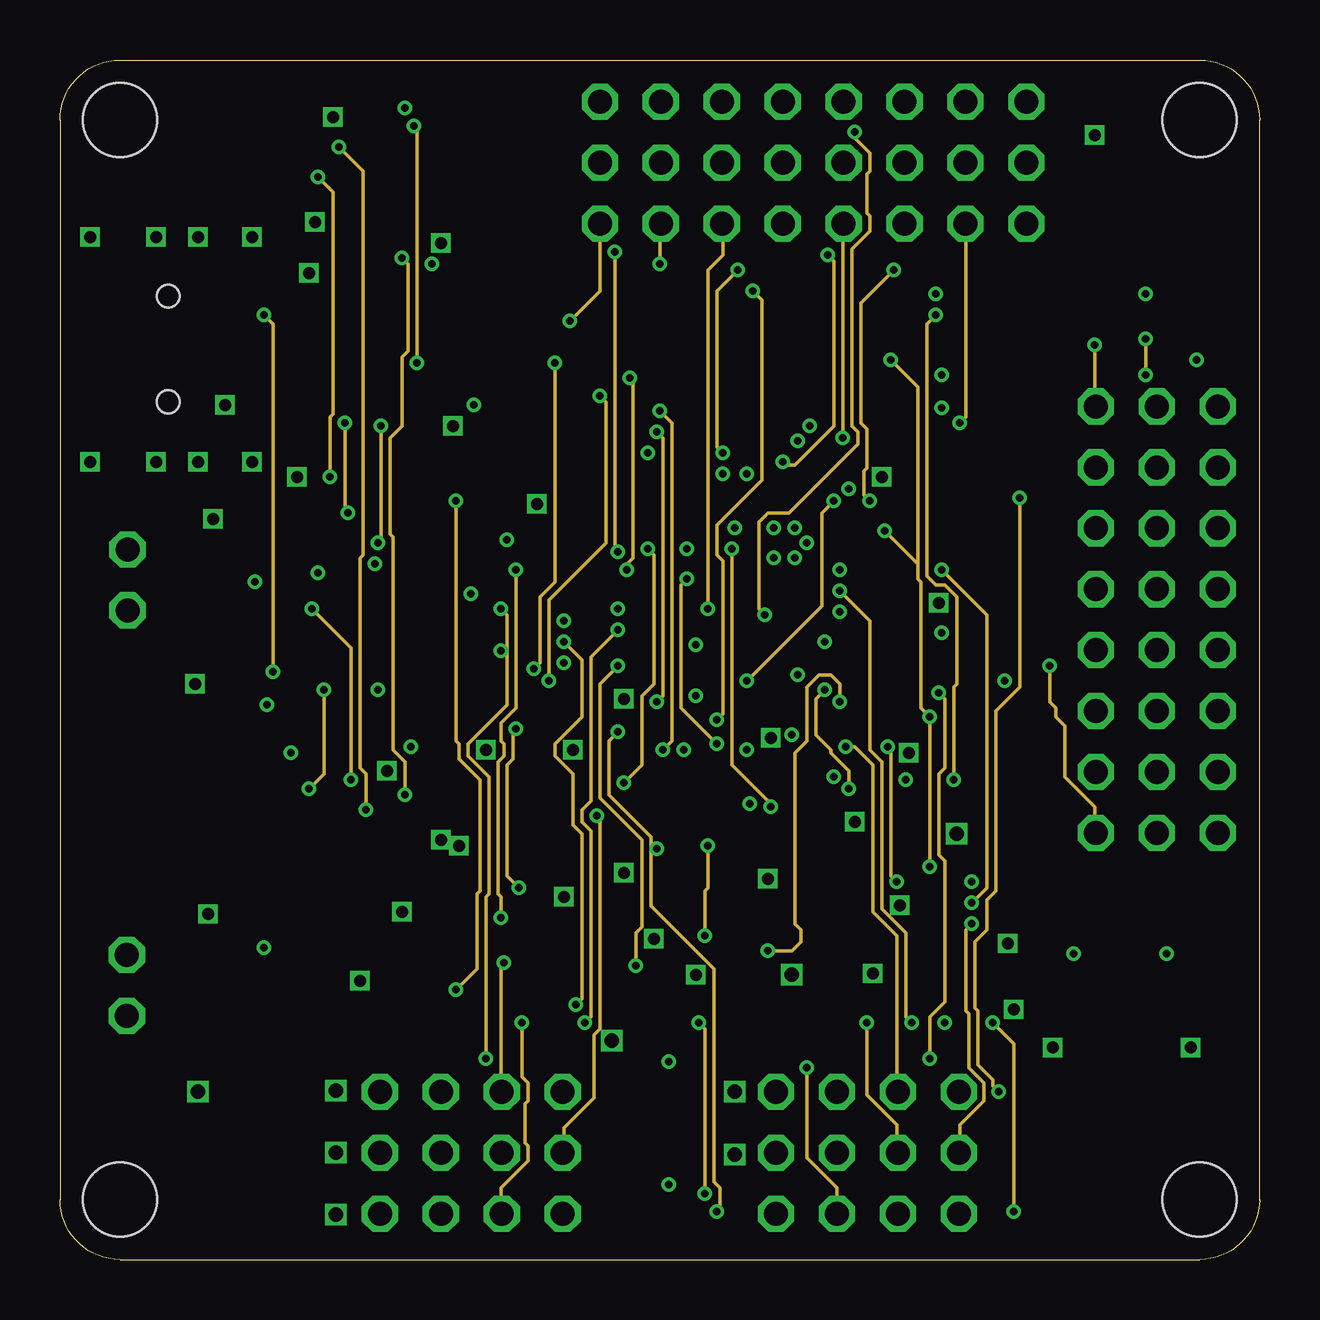
[diagram p6: board, inner layer Route15]
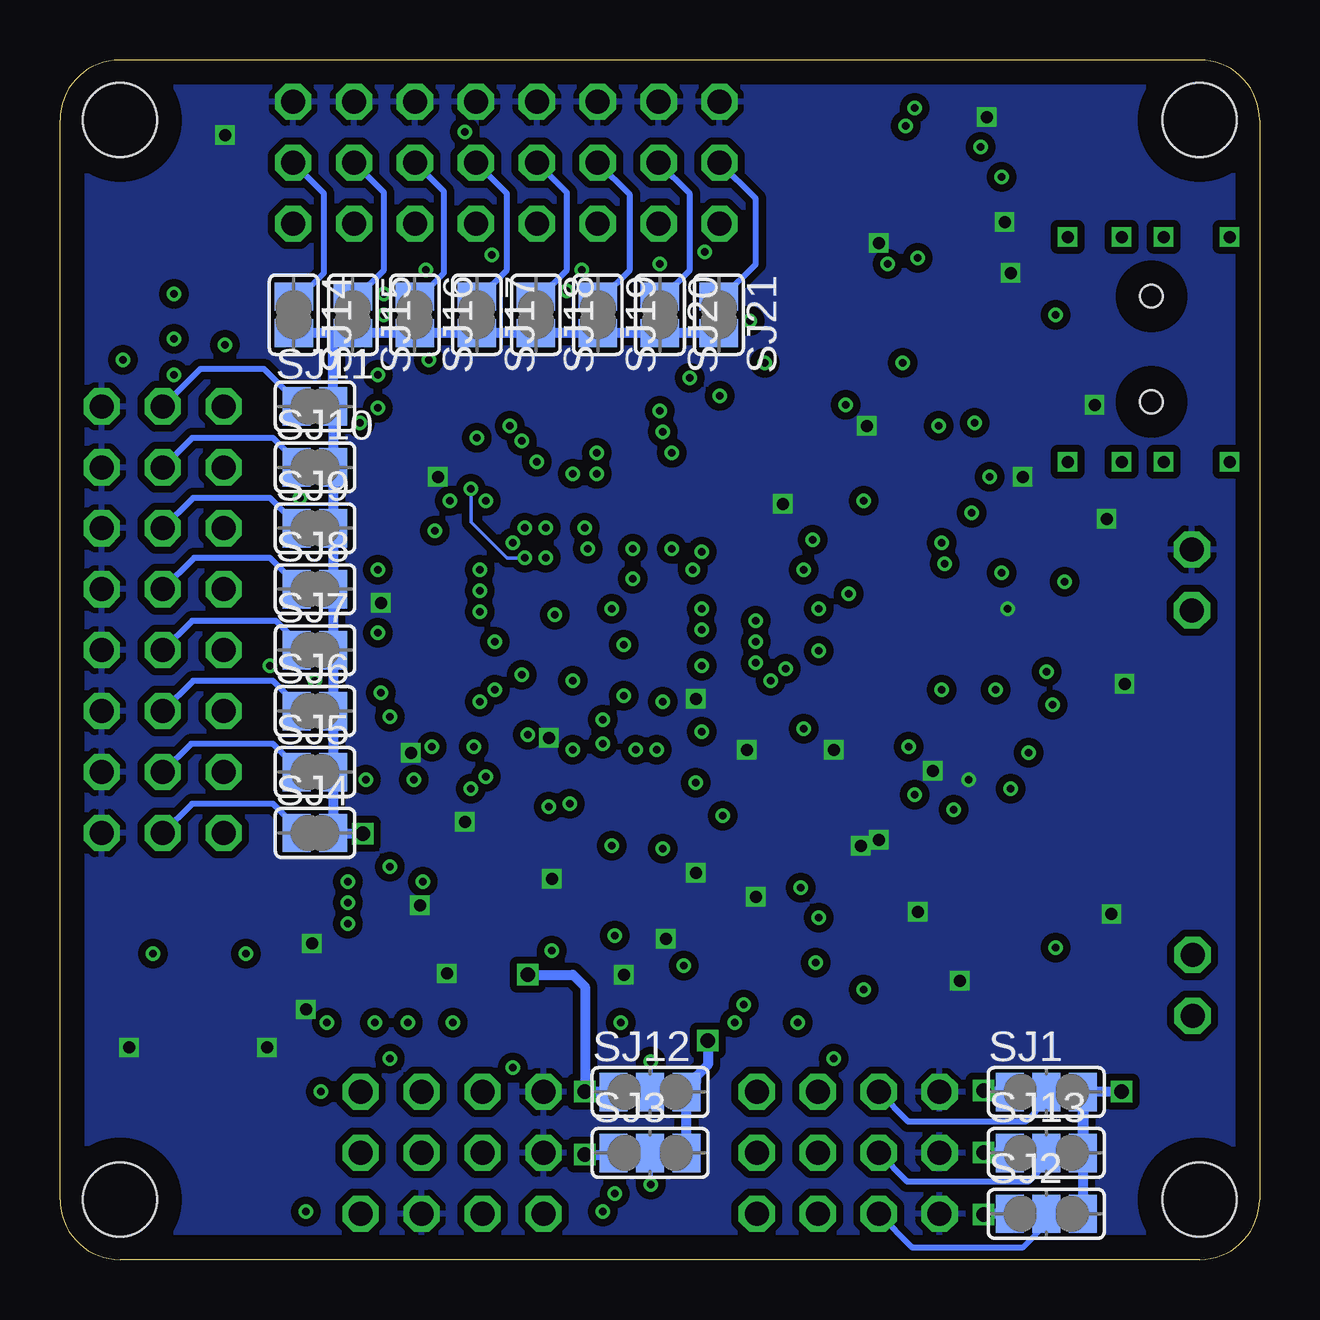
[diagram p7: board, bottom side, seen from below]

Size 50 x 50 mm. Coordinates in mm from the lower left corner, seen from the top.
Outline: 2.5,0 47.5,0 arc90 50,2.5 50,47.5 arc90 47.5,50 2.5,50 arc90 0,47.5 0,2.5 arc90 2.5,0
Copper layers (1*2+3*14+15*16): Top 0.035mm / dielectric 0.2mm / Route2 0.035mm / dielectric 0.41mm / Route3 0.035mm / dielectric 0.2mm / Route14 0.035mm / dielectric 0.41mm / Route15 0.035mm / dielectric 0.2mm / Bottom 0.035mm
Design rules "default": minimum track width 6mil, minimum drill 12mil, track to track 6mil, track to pad 6mil, pad to pad 6mil, via to via 6mil, smd to smd 6mil, copper to edge 40mil, drill to drill 6mil, minimum pad ring 10mil, minimum via ring 6mil, stop-mask expansion 0mil, vias tented up to drill 30mil, thermal gap 10mil
Holes 3.1 mm at 2.5,2.5 2.5,47.5 47.5,47.5 47.5,2.5

### Footprints (pad centres in the part's own frame; a part is rotated, then mirrored left to right if it is on the bottom)
C0402 = smd 0.7 x 0.9: 1 -0.65,0; 2 0.65,0
C0805 = smd 1.3 x 1.5: 1 -0.85,0; 2 0.85,0
C0603 = smd 1.1 x 1: 1 -0.85,0; 2 0.85,0
QFN24-4X4 = smd 0.7 x 0.25: 1 -1.9,1.25; 2 -1.9,0.75; 3 -1.9,0.25; 4 -1.9,-0.25; 5 -1.9,-0.75; 6 -1.9,-1.25; 13 1.9,-1.25; 14 1.9,-0.75; 15 1.9,-0.25; 16 1.9,0.25; 17 1.9,0.75; 18 1.9,1.25 | smd 0.25 x 0.7: 7 -1.25,-1.9; 8 -0.75,-1.9; 9 -0.25,-1.9; 10 0.25,-1.9; 11 0.75,-1.9; 12 1.25,-1.9; 19 1.25,1.9; 20 0.75,1.9; 21 0.25,1.9; 22 -0.25,1.9; 23 -0.75,1.9; 24 -1.25,1.9 | smd 2.45 x 2.45: EXP 0,0
SOT23-5 = smd 0.69 x 0.99: 1 -0.95,-1.29; 2 0,-1.29; 3 0.95,-1.29; 4 0.95,1.3; 5 -0.95,1.3
TQFP64 = smd 1.2 x 0.3: 1 -5.7,3.75; 2 -5.7,3.25; 3 -5.7,2.75; 4 -5.7,2.25; 5 -5.7,1.75; 6 -5.7,1.25; 7 -5.7,0.75; 8 -5.7,0.25; 9 -5.7,-0.25; 10 -5.7,-0.75; 11 -5.7,-1.25; 12 -5.7,-1.75; 13 -5.7,-2.25; 14 -5.7,-2.75; 15 -5.7,-3.25; 16 -5.7,-3.75; 33 5.7,-3.75; 34 5.7,-3.25; 35 5.7,-2.75; 36 5.7,-2.25; 37 5.7,-1.75; 38 5.7,-1.25; 39 5.7,-0.75; 40 5.7,-0.25; 41 5.7,0.25; 42 5.7,0.75; 43 5.7,1.25; 44 5.7,1.75; 45 5.7,2.25; 46 5.7,2.75; 47 5.7,3.25; 48 5.7,3.75 | smd 0.3 x 1.2: 17 -3.75,-5.7; 18 -3.25,-5.7; 19 -2.75,-5.7; 20 -2.25,-5.7; 21 -1.75,-5.7; 22 -1.25,-5.7; 23 -0.75,-5.7; 24 -0.25,-5.7; 25 0.25,-5.7; 26 0.75,-5.7; 27 1.25,-5.7; 28 1.75,-5.7; 29 2.25,-5.7; 30 2.75,-5.7; 31 3.25,-5.7; 32 3.75,-5.7; 49 3.75,5.7; 50 3.25,5.7; 51 2.75,5.7; 52 2.25,5.7; 53 1.75,5.7; 54 1.25,5.7; 55 0.75,5.7; 56 0.25,5.7; 57 -0.25,5.7; 58 -0.75,5.7; 59 -1.25,5.7; 60 -1.75,5.7; 61 -2.25,5.7; 62 -2.75,5.7; 63 -3.25,5.7; 64 -3.75,5.7
SOIC8 = smd 0.5 x 2.2: 1 -1.905,-3.154; 2 -0.645,-3.154; 3 0.625,-3.154; 4 1.895,-3.154; 5 1.905,3.154; 6 0.635,3.154; 7 -0.635,3.154; 8 -1.905,3.154
QFN8-5X3 = smd 1.1 x 0.6: 1 -1.1,1.875; 2 -1.1,0.625; 3 -1.1,-0.625; 4 -1.1,-1.875; 5 1.1,-1.875; 6 1.1,-0.625; 7 1.1,0.625; 8 1.1,1.875
LCC16-3X3 = smd 0.45 x 0.3: 1 -1.275,0.75; 2 -1.275,0.25; 3 -1.275,-0.25; 4 -1.275,-0.75; 9 1.275,-0.75; 10 1.275,-0.25; 11 1.275,0.25; 12 1.275,0.75 | smd 0.3 x 0.45: 5 -0.75,-1.275; 6 -0.25,-1.275; 7 0.25,-1.275; 8 0.75,-1.275; 13 0.75,1.275; 14 0.25,1.275; 15 -0.25,1.275; 16 -0.75,1.275
R0805 = smd 1.3 x 1.5: 1 -0.85,0; 2 0.85,0
50X32 = smd 1.8 x 1.2: 1 -2,-1.2; 2 2,-1.2; 3 2,1.2; 4 -2,1.2
R0603 = smd 1 x 1.1: 1 -0.85,0; 2 0.85,0
R0402 = smd 0.7 x 0.9: 1 -0.65,0; 2 0.65,0
KSCXXXJ = smd 2.8 x 1: 1 -2.9,2; 2 2.9,2; 3 -2.9,-2; 4 2.9,-2
SJ_2 = smd 1.168 x 1.6: 1 -1.524,0; 2 0,0; 3 1.524,0
SJ = smd 1.168 x 1.6: 1 -0.762,0; 2 0.762,0
SOD323-R = smd 0.6 x 0.6: A 1.1,0; C -1.1,0
CHIP-LED0805 = smd 1.2 x 1.2: A 0,-1.05; C 0,1.05
SOT23 = smd 1 x 1.4: 1 -0.95,-1.1; 2 0.95,-1.1; 3 0,1.1
67503-0020 = smd 0.5 x 2.25: 1 -1.6,0; 2 -0.8,0; 3 0,0; 4 0.8,0; 5 1.6,0 | smd 2.05 x 3.5: P$1 -4.725,0.025; P$2 4.725,0.025 | smd 2.05 x 4: P$3 -4.725,-4.225; P$4 4.725,-4.225 | hole 0.95: 2.2,-2.325; -2.2,-2.325
SSW-101-02-S-T = drill 1 pad 1.5 octagon: 1 0,-2.54; 2 0,0; 3 0,2.54
SSW-104-02-S-S = drill 1 pad 1.5 octagon: 1 -3.81,0; 2 -1.27,0; 3 1.27,0; 4 3.81,0
SSW-101-02-S-D = drill 1 pad 1.5 octagon: 1 0,-1.27; 2 0,1.27

### Placement (x,y rotation side)
C1  21.5,31.5 180 top
C2  17.88,16.38 90 top
C3  12.38,41.12 180 top
C4  12.88,48.12 180 top
C5  10.25,46.62 90 top
C6  34.45,17.25 90 top
C7  34.75,10.93 180 top
C8  14.5,11.62 180 top
C9  14.5,32 0 top
C10  10.5,31.62 180 top
C11  19.76,21.2 0 top
C12  29.38,17.25 270 top
C13  35.62,31.75 90 top
C14  7.25,29.5 180 top
C15  35.38,22.62 270 top
C16  11,26.12 0 top
C17  31.52,18.34 0 top
C18  28.88,14.75 0 top
C19  32.88,14.75 0 top
C20  32.27,11.8 90 top
C27  13.9,17.45 0 top
C41  15.41,20.37 180 top
C71  25.88,14.25 270 top
C76  21.5,33 180 top
C77  35.62,28.25 270 top
C78  19.76,19.69 180 top
D1  13.5,44.5 180 top
D2  38.12,14.3 0 top
D3  27.88,25.88 90 top
D4  15.88,26 0 top
D5  14.38,14.5 270 top
D6  14.5,34.75 90 top
D7  11.12,29.12 270 top
D8  29.18,11.64 270 top
L2  32.01,16.76 0 top
Q1  22.25,15.62 90 top
R1  10,23.62 90 top
R2  6.75,25.12 0 top
R3  6.75,27.12 180 top
R4  19.88,28.75 90 top
R5  18.38,13.38 180 top
R6  35.62,25.25 270 top
R7  18.38,11.38 180 top
R8  330R  [R0603]  33.62,35.88 270 top
R9  43.25,44.88 270 top
R10  27.88,17.25 270 top
R11  9.38,13 270 top
R12  37.75,10.93 180 top
R13  35.62,35.88 270 top
R14  34.75,12.93 0 top
R15  25.88,17.25 270 top
R16  10.5,34.75 270 top
R17  18.5,34.75 270 top
R19  11.5,21.12 180 top
R159  12.04,23.62 90 top
R184  10,37.75 0 top
R185  10,39 0 top
S1  44.17,9.79 0 top
SJ1  8.89,6.99 0 bottom
SJ2  8.89,1.91 0 bottom
SJ3  25.4,4.45 0 bottom
SJ4  39.37,17.78 0 bottom
SJ5  39.37,20.32 0 bottom
SJ6  39.37,22.86 0 bottom
SJ7  39.37,25.4 0 bottom
SJ8  39.37,27.94 0 bottom
SJ9  39.37,30.48 0 bottom
SJ10  39.37,33.02 0 bottom
SJ11  39.37,35.56 0 bottom
SJ12  25.4,6.99 0 bottom
SJ13  8.89,4.45 0 bottom
SJ14  40.26,39.38 270 bottom
SJ15  37.8,39.38 270 bottom
SJ16  35.21,39.38 270 bottom
SJ17  32.62,39.38 270 bottom
SJ18  30.16,39.38 270 bottom
SJ19  27.58,39.38 270 bottom
SJ20  25,39.38 270 bottom
SJ21  22.54,39.38 270 bottom
U$1  [FINEDOT]  6.28,45.94 0 top
U$2  [FINEDOT]  42.41,3.08 0 top
U$3  [FINEDOT]  45.26,44.25 0 top
V1  6.75,23.25 180 top
V2  47.38,38.38 90 top
V3  25.5,10.75 180 top
V4  47.38,40.38 90 top
V5  11.25,18.5 90 top
V6  47.38,42.38 90 top
V7  9.38,10.38 180 top
V8  6.38,13 90 top
X1  6.83,37.95 270 top
X2  45.72,17.78 270 top
X3  45.72,20.32 270 top
X4  45.72,22.86 270 top
X5  45.72,25.4 270 top
X6  45.72,27.94 270 top
X7  45.72,30.48 270 top
X8  45.72,33.02 270 top
X9  45.72,35.56 270 top
X10  25.05,45.72 0 top
X11  33.66,4.45 0 top
X12  17.14,1.91 0 top
X13  17.14,6.99 0 top
X14  2.81,28.33 0 top
X15  33.66,6.99 0 top
X16  33.66,1.91 0 top
X17  17.14,4.45 0 top
X18  2.79,11.43 0 top
X20  40.28,45.72 0 top
X21  37.74,45.72 0 top
X22  35.2,45.72 0 top
X23  32.66,45.72 0 top
X24  30.12,45.72 0 top
X25  27.59,45.72 0 top
X26  22.5,45.72 0 top

### Tracks (layer width: path | path; a pad name or v marks a point on that pad's centre or on a via)
+5V  (via drill 0.6)
  Top 0.406: 20.77,9.15 20.75,9.12 v23,9.12 | v23,9.12 8.25,9.12 | 5.75,9.12 3.83,9.12 X18.1 | V7.A 8.28,9.15 8.25,9.12 | 8.25,9.12 5.75,9.12 | 5.75,9.12 v5.75,7 | v23,9.12 24.38,9.12 | 24.38,9.12 40.12,9.12 41.25,10.25 42.88,10.25 43.5,10.88 43.5,15.25 42.88,15.88 41.25,15.88 39.38,17.75 v37.38,17.75 | V3.A 24.4,9.15 24.38,9.12
  Bottom 0.406: SJ3.3 SJ12.3 23.5,7.36 23.5,7.62 23,8.12 v23,9.12 | SJ13.3 SJ1.3 SJ2.3 7.35,7 v5.75,7 | SJ21.2 SJ20.2 SJ19.2 SJ18.2 SJ17.2 SJ16.2 SJ15.2 38.75,38.62 | 38.75,38.62 SJ14.2 | 38.75,38.62 38.61,38.48 SJ11.2 SJ10.2 SJ9.2 SJ8.2 SJ7.2 SJ6.2 SJ5.2 SJ4.2 38.58,17.75 v37.38,17.75
+5V_USB  (via drill 0.3)
  Top 0.152: v10.38,19.62 11.25,19.62 V5.A | v11,23.75 10.25,24.5 10,24.5 | v8.5,39.38 8.38,39.5 6.88,39.5 X1.1 | 10,24.5 v8.88,24.5 | 10,24.5 R1.2
  Route15 0.152: v10.38,19.62 11,20.25 v11,23.75 | v8.5,39.38 8.88,39 v8.88,24.5
+24V+USB
  Top 0.406: V7.C 10.5,13.5 | 10.5,13.5 10.5,17.38 11.22,17.38 V5.C 13.26,17.4 C27.1 13.09,17.23 D5.1 | D5.3 10.55,13.55 10.5,13.5
/RESET  (via drill 0.3)
  Top 0.152: v42.25,12.75 41.38,11.88 S1.1 | v46.12,12.75 47,11.88 S1.2 | v27,17.25 27,17.38 27.75,18.12 R10.1
  Top 0.254: D3.7 27.12,18.85 R10.1 28.02,18.1 28.25,17.88 29.35,17.88 C12.1
  Route2 0.152: 42.38,12.62 46,12.62 v46.12,12.75 | v26.88,13.5 27.12,13.75 30.38,13.75 31.5,12.62 39.12,12.62 39.25,12.5 42.25,12.5 42.38,12.62 | 42.38,12.62 v42.25,12.75
  Route15 0.152: v27,17.25 27,15.5 26.88,15.38 v26.88,13.5
BATT  (via drill 0.3)
  Top 0.152: D3.4 25.62,20.88 v26,21.25 | v8.62,23.12 8.5,23.25 V1.C
  Top 0.406: V1.C 7.85,24.88 R2.2 R3.1
  Route2 0.152: v26,21.25 24.62,22.62 19.38,22.62 18.88,23.12 v8.62,23.12
DAC  (via drill 0.3)
  Top 0.152: D3.20 32.88,23.62 v32.5,23.25 | v8.5,13 9.25,13.75 9.25,13.88 9.38,13.88 R11.1
  Route2 0.152: v29.5,12.88 29.25,12.62 24.5,12.62 24.25,12.88 23.75,12.88 23.62,12.75 19,12.75 18.75,13 v8.5,13
  Route15 0.152: v32.5,23.25 32.5,24 32.12,24.38 31.62,24.38 31.12,23.88 31.12,21.62 30.62,21.12 30.62,14 30.88,13.75 30.88,13.25 30.5,12.88 v29.5,12.88
EXTI  (via drill 0.3)
  Top 0.152: D7.15 12.75,29.38 v13.12,29 | v27.38,21.5 28.12,20.75 D3.9
  Route2 0.152: v13.12,29 13.75,28.38 17.38,28.38 17.62,28.12 25.88,28.12 v26.12,28.38
  Route15 0.152: v26.12,28.38 25.88,28.12 25.88,23 v27.38,21.5
FLASH  (via drill 0.3)
  Top 0.152: R159.1 12.12,22.75 13.88,22.75 D4.1 14,22.88 14,23 v13.25,23.75 | v32.25,31.62 31.62,31.62 D3.33
  Route2 0.152: v28.62,24.12 21.38,24.12 20.75,23.5 13.5,23.5 v13.25,23.75
  Route15 0.152: v32.25,31.62 31.75,31.12 31.75,27.25 v28.62,24.12
GND  (via drill 0.3, 0.5)
  Top 0.152: 17.77,21.38 17.75,21.38 v17.75,21.25 | D7.9 10.38,27.25 v10.5,27.12 10.88,27.12 11.38,27.62 D7.11 | v12.12,20 12.38,20.25 12.38,21.12 R19.1
  Top 0.254: X1.5 6.88,36.35 v6.88,35.62 | C5.2 10.25,47.25 10.5,47.25 10.5,47.5 11.38,47.5 v11.38,47.62 11.38,47.88 12.22,47.88 C4.2 12.75,47.6 D1.11 | D1.1 15.75,43.25 15.88,43.12 v15.88,42.38 | C3.2 10.4,41.15 v10.38,41.12 | D1.18 v10.62,43.25 | C1.2 v19.88,31.5 19.85,32.25 C76.2 | v34.25,32.62 C13.2 | v43.12,46.88 43.25,46.77 R9.1 | v36.62,27.38 C77.2 | D3.18 34.62,22.62 35,22.25 C15.2 v35.38,21.12 | D3.12 v29.62,21.75 | C17.2 32.22,18.25 v33.12,18.25 33.25,18.12 34.25,18.12 34.45,17.93 C6.2 | v29.5,15.88 C12.2 | v24.75,13.38 25.75,13.38 25.75,13.25 25.88,13.34 C71.2 | D3.63 23.25,22.62 23.5,22.88 v23.5,23.38 23.5,23.88 23.25,24.12 D3.60 | D4.4 17.77,21.38 17.77,21.23 | C41.2 14.62,20.13 v13.62,20.38 | v41.38,8.84 41.38,8.2 S1.3 | v47.12,8.84 47.12,8.25 S1.4 | D2.3 39.46,13.13 v39.5,13.18 | C7.2 v33.88,11.93 R14.1 33.62,12.65 C20.2 | R12.1 38.7,10.93 39,10.62 39.55,10.62 v39.75,10.43 | v35,14.77 33.74,14.77 C19.2 | C14.2 6.4,30.85 v6.38,30.88 | C10.2 9.85,32.6 v9.88,32.62 | C9.2 15.15,33.62 D6.3 D6.4 v16.38,34.75 D6.5 | v21.38,21.25 20.41,21.25 C11.2 | C78.2 18.62,19.69 18.62,20 18.25,20 18,20.25 18,21 v17.75,21.25 | Q1.2 23.45,16.18 v23.5,16.12 | v21,15.12 21,13.68 Q1.4
  Top 0.406: C2.2 16.65,17.23 v16.62,17.25 | v12.5,11.62 C8.2 | D5.2 v14.25,14.5 | V1.A 5.65,23.98 v5.62,24 5.62,24.85 R2.1 | V8.2 7.12,13.95 7.12,14.12 6.45,14.12 v6.17,14.4 | D8.2 26.73,11.64 v26.5,11.88 | v29.5,15.88 29.5,14.97 C18.2 | X17.1 X13.1 X12.1 | X11.1 X15.1
  Top 0.61: v15.88,17.5 15.93,17.45 C27.2
  Route15 0.152: v10.5,27.12 12.12,25.5 v12.12,20
  pour Bottom (isolate 0.305): 1,49 1,1 49,1 49,49
HL
  Top 0.254: D3.47 24.62,32.75 24.38,33 C76.1
IIUPO
  Top 0.254: D3.31 35.6,29.12 C77.1
INT_MPU6000  (via drill 0.3)
  Top 0.152: v11.62,46.38 12.25,46.38 D1.12 | v28.75,19 28.12,19 27.62,19.5 D3.8
  Route2 0.152: v12.75,18.75 12.88,18.62 20.88,18.62 22,17.5 22.75,17.5 23,17.75 23.25,17.75 24.5,19 v28.75,19
  Route15 0.152: v11.62,46.38 12.62,45.38 12.62,29.38 12.5,29.25 12.5,20.5 12.75,20.25 v12.75,18.75
MISO  (via drill 0.3)
  Top 0.152: v28.62,21.25 D3.10 | v14.62,21.38 15.25,22 15.25,22.75 D4.2
  Route2 0.152: v28.62,21.25 27.88,20.5 15.5,20.5 v14.62,21.38
MISO2  (via drill 0.3)
  Top 0.152: D1.9 13.75,47.12 14.38,47.75 v14.38,48 | v29.38,26.88 31.5,24.75 32.12,24.75 32.25,24.62 D3.22
  Route2 0.152: v14.38,48 14.5,47.88 20.5,47.88 21.38,47 v33.12,47
  Route15 0.152: v33.12,47 33.12,46.75 33.75,46.12 33.75,45.38 33.62,45.25 33.62,43.62 33.75,43.5 33.75,42.88 33,42.12 33,34.75 33.25,34.5 33.25,34 30.38,31.12 29.5,31.12 29.12,30.75 29.12,27.12 v29.38,26.88
MOSI  (via drill 0.3)
  Top 0.152: v18.62,30 17.88,29.25 D4.5 | v29.62,18.88 29.38,19.12 29.38,19.25 29.12,19.5 D3.11
  Route2 0.152: v18.62,30 18.88,30.25 27.38,30.25 v28,29.62
  Route15 0.152: v28,29.62 28,20.62 29.62,19 v29.62,18.88
MOSI2  (via drill 0.3)
  Top 0.152: D3.23 31.62,25.12 31.25,25.5 31.25,29.12 v33.75,31.62 | v15.5,41.5 14.75,42.25 D1.24
  Route2 0.152: v34.75,41.25 34.62,41.12 32.62,41.12 32.38,40.88 30.25,40.88 29.12,39.75 28.62,39.75 28.12,40.25 25.75,40.25 25.12,40.88 23.38,40.88 22.62,41.62 15.62,41.62 v15.5,41.5
  Route15 0.152: v33.75,31.62 33.5,31.88 33.5,32.88 33.62,33 33.62,34.62 33.38,34.88 33.38,39.88 v34.75,41.25
MPU6000  (via drill 0.3)
  Top 0.152: D3.24 32,25.62 v31.88,25.75 | v26.5,25.62 23.62,28.5 v23.62,28.75 | v14.75,47.25 14.25,46.75 D1.8
  Route2 0.152: v31.88,25.75 31.75,25.62 31.25,25.62 31,25.88 26.75,25.88 v26.5,25.62 | v23.75,36.75 15.5,36.75 v14.88,37.38
  Route15 0.152: v23.62,28.75 23.62,29 23.88,29.25 23.88,36.62 v23.75,36.75 | v14.88,37.38 14.88,47.12 v14.75,47.25
N$1
  Bottom 0.254: SJ1.2 8.89,6.61 9.75,5.75 14.64,5.75 X13.2
N$2  (via drill 0.3)
  Top 0.152: v36.75,35.5 36.25,35 35.62,35 R13.2 | D3.3 v25.12,21.25
  Route2 0.152: v36.75,35.5 36.5,35.25 31.62,35.25 31.5,35.38 v25,35.38
  Route15 0.152: v25,35.38 25.5,34.88 25.5,21.62 v25.12,21.25
N$3
  Top 0.254: L2.1 30.91,16.88 30.88,16.88 C17.1 30.12,19.21 D3.13
N$4
  Top 0.406: V3.C 26.66,10.69 D8.3 27.95,10.75 28.75,10.75 29,11 29,12.38 28.79,12.59 D8.1 27.89,14.62 C18.1
N$5
  Bottom 0.254: SJ4.1 40.13,18.01 41.12,19 44.5,19 X2.2
N$6
  Bottom 0.254: SJ2.2 8.89,1.49 9.88,0.5 14.47,0.5 X12.2
N$7  (via drill 0.3)
  Route2 0.152: v25.38,3.12 25.62,3.38 30.25,3.38 31.38,4.5 32.38,4.5 X11.2
  Bottom 0.152: v25.38,3.12 25.38,4.38 SJ3.2
N$8
  Top 0.254: D3.5 26.12,19.38 25.88,19.12 21.12,19.12 21,19.25 | C78.1 20.68,19.69 21,19.38 21,19.25 | 21,19.25 21,17.68 Q1.3
N$9
  Bottom 0.254: SJ5.1 40.13,20.51 41.12,21.5 44.54,21.5 X3.2
N$10
  Bottom 0.254: SJ6.1 40.13,23.13 41.12,24.12 44.45,24.12 X4.2
N$11  (via drill 0.3)
  Top 0.152: v36.75,36.88 36.62,36.75 35.62,36.75 R13.1 | V2.C v45.25,38.38
  Route2 0.152: v36.75,36.88 37,37.12 45,37.12 v45.25,36.88
  Route15 0.152: v45.25,38.38 v45.25,36.88
N$12
  Bottom 0.254: SJ7.1 40.13,25.76 41,26.62 44.49,26.62 X5.2
N$13
  Bottom 0.254: SJ8.1 40.13,28.13 41.25,29.25 44.41,29.25 X6.2
N$14
  Bottom 0.254: SJ9.1 40.13,30.63 41.25,31.75 44.45,31.75 X7.2
N$15
  Bottom 0.254: SJ10.1 40.13,33.26 41.12,34.25 44.49,34.25 X8.2
N$16
  Bottom 0.254: SJ11.1 40.13,35.76 41.5,37.12 44.16,37.12 X9.2
N$17
  Top 0.406: R3.2 2.88,27.12 X14.1
N$18
  Top 0.254: D1.20 12.75,41.6 C3.1
N$19
  Top 0.254: D1.10 13.25,47.73 C4.1
N$20  (via drill 0.3)
  Top 0.152: R8.1 33.62,37.38 v36.5,40.25 | v45.25,40.25 45.38,40.38 V4.C
  Route2 0.152: v45.25,40.25 v36.5,40.25
N$21  (via drill 0.3)
  Top 0.152: D3.2 24.62,20.88 24.5,21 24.5,22.88 v24.88,23.25 | v31.25,34.75 31.75,34.75 32,35 33.62,35 R8.2
  Route2 0.152: v24.88,34.5 25.12,34.75 25.25,34.75 25.5,35 31,35 v31.25,34.75
  Route15 0.152: v24.88,23.25 25.12,23.5 25.12,34.25 v24.88,34.5
N$22
  Top 0.254: V6.C 43.62,42.38 43.25,42.75 R9.2
N$23  (via drill 0.3)
  Route2 0.152: v25.38,8.25 25.5,8.38 29.88,8.38 31.25,7 X15.2
  Bottom 0.152: v25.38,8.25 25.38,7 SJ12.2
N$24
  Bottom 0.254: SJ13.2 8.89,3.98 9.62,3.25 14.68,3.25 X17.2
N$25  (via drill 0.3)
  Top 0.152: D2.2 38.12,12.75 36.88,11.5 36.88,11 R12.2 36.88,10.88 v36.88,9.88
  Route2 0.152: v36.88,9.88 35.75,8.75 25.75,8.75 25.62,8.88 25.12,8.88 22,5.75 20.75,5.75 19.5,4.5 18.5,4.5 X17.3
N$26
  Top 0.254: R15.2 C71.1 25.88,15.25 25.62,15.5 25.62,14.75 24.25,14.75 23.88,14.38 23.88,14.05 Q1.1
N$27
  Top 0.406: C8.1 15.5,11.62 15.5,13.5 15.72,13.5 D5.4
N$28
  Top 0.254: D3.6 26.62,18.85 R15.1
N$29
  Bottom 0.254: SJ14.1 39.98,40.14 39,41.12 39,44.44 X20.2
N$30
  Bottom 0.254: SJ15.1 37.61,40.14 36.5,41.25 36.5,44.48 X21.2
N$31
  Bottom 0.254: SJ16.1 34.98,40.14 34,41.12 34,44.52 X22.2
N$32
  Bottom 0.254: SJ17.1 32.48,40.14 31.38,41.25 31.38,44.43 X23.2
N$33
  Bottom 0.254: SJ18.1 29.98,40.14 28.88,41.25 28.88,44.47 X24.2
N$34
  Bottom 0.254: SJ19.1 27.36,40.14 26.25,41.25 26.25,44.38 X25.2
N$35
  Bottom 0.254: SJ20.1 24.86,40.14 23.75,41.25 23.75,44.42 X10.2
N$36
  Bottom 0.254: SJ21.1 22.36,40.14 21,41.5 21,44.22 X26.2
N$37  (via drill 0.3)
  Top 0.152: D7.10 10.88,28.5 v10.75,28.62 | v8.12,28.25 8.12,29.5 C14.1
  Route2 0.152: v10.75,28.62 10.38,28.25 v8.12,28.25
N$38
  Top 0.254: D7.8 9.85,26.43 C16.1
N$39
  Top 0.254: D7.12 11.88,26.15 C16.2
N$40
  Top 0.406: D8.4 32.01,10.69 C20.1
N$41  (via drill 0.5)
  other vias: 4,42.62
N$42  (via drill 0.5)
  other vias: 1.25,42.62
N$43  (via drill 0.5)
  other vias: 5.75,42.62
N$44
  Top 0.406: X18.2 4.97,12.7 V8.3
N$45
  Top 0.406: V8.1 9.28,12.05 R11.2
N$46  (via drill 0.5)
  other vias: 8,42.62
N$47  (via drill 0.5)
  other vias: 1.25,33.25
N$48  (via drill 0.5)
  other vias: 4,33.25
N$49  (via drill 0.5)
  other vias: 5.75,33.25
N$50  (via drill 0.5)
  other vias: 8,33.25
N$228
  Top 0.254: X1.2 9.1,38.75 R185.1
N$229
  Top 0.152: 9.38,37.62 R184.1
  Top 0.254: X1.3 9.15,37.95 R184.1
PMWIN4  (via drill 0.3)
  Top 0.152: v28.62,32.75 D3.39
  Route2 0.152: v28.62,32.75 28.75,32.62 31,32.62 v32.62,34.25
  Route15 0.152: v32.62,34.25 32.62,43.12 X23.1
PWM1  (via drill 0.3)
  Top 0.152: D3.56 21.5,26.12 v21,26.62
  Route2 0.152: v21,26.62 22.25,25.38 23.88,25.38 24.38,24.88 28,24.88 28.25,25.12 32,25.12 32.5,24.62 35,24.62 35.38,25 41,25 v41.25,24.75
  Route15 0.152: v41.25,24.75 41.25,23.25 41.5,23 41.5,22.62 41.88,22.25 41.88,20.12 43.12,18.88 43.12,17.88 X2.1
PWM2  (via drill 0.3)
  Top 0.152: v26.5,23.5 25.88,23.5 23.75,25.62 D3.57
  Route2 0.152: v26.5,23.5 29.88,23.5 30.25,23.12 31.75,23.12 32.88,22 36.12,22 37.75,20.38 43.12,20.38 X3.1
PWM3  (via drill 0.3)
  Top 0.152: v39.38,24.12 37.75,24.12 36.88,25 36.5,25 36.25,25.25 35,25.25 34.75,25.5 34.75,26.12 34.25,26.62 D3.26
  Route2 0.152: v39.38,24.12 40.62,22.88 43.12,22.88 X4.1
PWM4  (via drill 0.3)
  Top 0.152: v32.5,27 32.62,27.12 D3.27
  Route2 0.152: v32.5,27 33.88,27 35.5,25.38 43.12,25.38 X5.1
PWM5  (via drill 0.3)
  Top 0.152: v30.62,30.5 D3.35
  Route2 0.152: v30.62,30.5 30.75,30.62 33.25,30.62 35.75,28.12 41.5,28.12 41.62,28 43.12,28 X6.1
PWM6  (via drill 0.3)
  Top 0.152: D3.36 30.12,30.88 v29.75,30.5
  Route2 0.152: v29.75,30.5 30.38,31.12 30.88,31.12 31,31 41.12,31 41.62,30.5 43.12,30.5 X7.1
PWM7  (via drill 0.3)
  Top 0.152: D3.61 20.88,23.62 v20.38,24.12
  Route2 0.152: v22.5,36 25.25,36 25.5,35.75 31.62,35.75 31.75,35.62 36,35.62 36.5,36.12 38.5,36.12 41.62,33 43.12,33 X8.1
  Route15 0.152: v20.38,24.12 20.38,27.5 22.75,29.88 22.75,35.75 v22.5,36
PWM8  (via drill 0.3)
  Top 0.152: D3.62 20.5,23.12 19.75,23.88 v19.75,24.62
  Route2 0.152: v20.62,37.38 21.38,38.12 34.88,38.12 35.12,37.88 42.88,37.88 v43.12,38.12
  Route15 0.152: v19.75,24.62 20,24.88 20,27.62 20.62,28.25 v20.62,37.38 | v43.12,38.12 43.12,35.62 X9.1
PWMIN1  (via drill 0.3)
  Top 0.152: D3.43 26.62,32.62 v27.62,33.62
  Route2 0.152: v28.25,41.25 32.25,41.25 32.5,41.5 33,41.5 33.38,41.88 37.88,41.88 39.12,43.12 40.25,43.12 X20.1
  Route15 0.152: v27.62,33.62 27.38,33.88 27.38,40.38 v28.25,41.25
PWMIN2  (via drill 0.3)
  Top 0.152: D3.37 29.62,32.25 30,32.62 30.38,32.62 30.75,33 v30.75,34.12
  Route2 0.152: v30.75,34.12 31.62,34.12 32.38,34.88 v37.5,34.88
  Route15 0.152: v37.5,34.88 37.75,35.12 37.75,43.12 X21.1
PWMIN3  (via drill 0.3)
  Top 0.152: D3.38 29.12,32.25 v30.12,33.25
  Route2 0.152: v32,41.88 32.88,41.88 34.12,43.12 35.12,43.12 X22.1
  Route15 0.152: v30.12,33.25 30.25,33.12 30.62,33.12 32.25,34.75 32.25,41.62 v32,41.88
PWMIN5  (via drill 0.3)
  Top 0.152: D3.50 22.88,29.12 v23.25,29.5
  Route2 0.152: v23.12,42 23.38,42.25 24.5,42.25 24.62,42.12 28,42.12 29,43.12 30.12,43.12 X24.1
  Route15 0.152: v23.25,29.5 23.12,29.62 v23.12,42
PWMIN6  (via drill 0.3)
  Top 0.152: D3.55 22.75,26.62 v23.25,27.12
  Route2 0.152: v23.25,27.12 23.5,27.38 26.75,27.38 v27,27.12
  Route15 0.152: v27,27.12 27,41.25 27.62,41.88 27.62,43.12 X25.1
PWMIN7  (via drill 0.3)
  Top 0.152: D3.14 30.62,21.75 v30.5,21.88
  Route2 0.152: v30.5,21.88 29.88,22.5 v27.38,22.5 | v28.88,40.38 28.62,40.62 25.88,40.62 v25,41.5
  Route15 0.152: v27.38,22.5 27.62,22.75 27.62,29.12 27.38,29.38 27.38,30.62 29.25,32.5 29.25,40 v28.88,40.38 | v25,41.5 25,43.12 X10.1
PWMIN8  (via drill 0.3)
  Top 0.152: v35.25,20 33.38,20 32.62,20.75 32.12,20.75 31.75,21.12 31.5,21.12 31.12,20.75 D3.15
  Route2 0.152: v21.25,39.12 21.88,38.5 35.62,38.5 v36.5,39.38 | v35.25,20 v37.25,20
  Route15 0.152: v21.25,39.12 22.5,40.38 22.5,43.12 X26.1 | v36.5,39.38 36.12,39 36.12,28.5 36.5,28.12 36.88,28.12 37.38,27.62 37.38,24 37.25,23.88 v37.25,20
RX1  (via drill 0.3)
  Top 0.152: v18.5,12.38 19.25,13.12 19.25,13.38 R5.1 | D3.59 23.12,24.62 v23.25,24.75
  Route2 0.152: v24,12.25 23.88,12.38 v18.5,12.38
  Route15 0.152: v18.5,12.38 18.38,12.25 18.38,7 X13.3 | v23.25,24.75 22.5,24 22.5,19.25 24.25,17.5 24.25,13.88 24,13.62 v24,12.25
RX2  (via drill 0.3)
  Top 0.152: v38,15.75 38.12,15.62 39,15.62 D2.4 | v34.5,21.38 34.5,21.5 33.88,22.12 D3.17
  Route2 0.152: v34.88,15.75 v38,15.75
  Route15 0.152: v34.88,15.75 34.62,16 34.62,21.25 v34.5,21.38
RX3  (via drill 0.3)
  Top 0.152: v19.25,9.88 19.25,11.38 R7.1 | D3.30 32.62,28.62 v32.5,28.75
  Route2 0.152: v32.5,28.75 30,26.25 v23.25,26.25 | v21.88,9.88 21.75,9.75 19.38,9.75 v19.25,9.88
  Route15 0.152: v19.25,9.88 19.25,7.62 19.5,7.38 19.5,6.62 19.38,6.5 19.38,4.88 19.5,4.75 19.5,4.12 18.38,3 18.38,2 X12.3 | v23.25,26.25 22.12,25.12 22.12,19.12 21.75,18.75 21.75,18.25 22.12,17.88 22.12,10.12 v21.88,9.88
RX4  (via drill 0.3)
  Top 0.152: v32.75,21.38 29.12,25 26.25,25 23.12,28.12 D3.52
  Route15 0.152: v32.75,21.38 33.12,21.38 33.88,20.62 33.88,14.5 34.88,13.5 34.88,7 X15.3
RX5  (via drill 0.3)
  Top 0.152: v21,25.75 20.38,26.38 20.38,26.88 20.88,27.38 21.25,27.38 21.5,27.12 D3.54
  Route2 0.152: v33.62,9.88 32.88,10.62 v21.5,10.62
  Route15 0.152: v33.62,9.88 33.62,6.88 34.88,5.62 34.88,4.5 X11.3 | v21.5,10.62 21.75,10.88 21.75,17.75 21.38,18.12 21.38,20.25 20.62,21 20.62,21.5 21.75,22.62 21.75,25 v21,25.75
SBUS  (via drill 0.3)
  Top 0.152: D3.28 34.38,27.62 35,28.25 36.25,28.25 v36.75,28.75 | v38,14.88 37.12,14 37.12,13.12 D2.1
  Top 0.254: D2.1 36.97,12.93 R14.2 C7.1
  Route15 0.152: v36.75,28.75 38.62,26.88 38.62,15.5 v38,14.88
SCK  (via drill 0.3)
  Top 0.152: D3.34 31.12,30.88 31.38,30.62 31.38,30.38 31.12,30.12 v31.12,29.88 | v17.12,27.75 16.5,28.38 16.5,29.12 D4.6
  Route2 0.152: v31.12,29.88 29.12,29.88 27,27.75 v17.12,27.75
SCK2  (via drill 0.3)
  Top 0.152: D3.21 32.25,24.12 v31.88,23.75 | D1.23 v14.25,41.75
  Route2 0.152: v32.88,19.62 32.62,19.62 32.5,19.5 32,19.5 31.75,19.75 24.75,19.75 23.12,18.12 22.88,18.12 22.62,17.88 22.12,17.88 20.25,19.75 14.75,19.75 v14.38,19.38
  Route15 0.152: v31.88,23.75 31.5,23.38 31.5,21.88 32.12,21.25 32.12,21.12 32.88,20.38 v32.88,19.62 | v14.38,19.38 14.38,20.75 13.88,21.25 13.88,30.12 13.75,30.25 13.75,34.25 14.25,34.75 14.25,37.62 14.5,37.88 14.5,41.5 v14.25,41.75
SCL  (via drill 0.3)
  Top 0.152: D7.1 11.88,31 v12,31.12 | D6.8 12.62,35.62 v11.88,34.88 11.12,35.62 10.5,35.62 R16.1 | v27.62,32.75 D3.41
  Route2 0.152: v27.62,32.75 27.12,32.25 19.62,32.25 18.38,31 12.12,31 v12,31.12
  Route15 0.152: v12,31.12 11.88,31.25 v11.88,34.88
SDA  (via drill 0.3)
  Top 0.152: v13.25,29.88 D7.16 | v13.38,34.75 13.88,35.25 D6.7 | v17.25,35.62 18.5,35.62 R17.1 | v28.12,30.5 D3.40
  Route2 0.152: v17.25,35.62 17.12,35.5 14.12,35.5 v13.38,34.75 | v28.12,30.5 28,30.62 14,30.62 v13.25,29.88
  Route15 0.152: v13.25,29.88 13.38,30 v13.38,34.75
SWCLK  (via drill 0.3)
  Top 0.152: D3.49 22.5,29.62 23,30.12 23.5,30.12 23.88,29.75 23.88,29.38 27.88,25.38 29.25,25.38 30.25,24.38 v30.75,24.38
  Route2 0.152: v30.75,24.38 32.25,24.38 33,23.62 v36.62,23.62 | v36.25,8.38 31.5,8.38 v31.12,8
  Route15 0.152: v36.62,23.62 36.88,23.38 36.88,20.5 36.62,20.25 36.62,16.88 36.88,16.62 36.88,10.75 36.25,10.12 v36.25,8.38 | v31.12,8 31.12,4.25 32.38,3 32.38,2 X16.2
SWDIO  (via drill 0.3)
  Top 0.152: D3.46 25.12,32.88 24.5,33.5 v24.5,33.62
  Route2 0.152: v24.5,33.62 23.5,32.62 19.5,32.62 18.5,31.62 v16.5,31.62 | v16.5,11.25 21.75,11.25 22,11 33,11 33.5,10.5 38.25,10.5 v38.88,9.88 | v39.75,2 39.62,1.88 37.5,1.88 X16.4
  Route15 0.152: v16.5,31.62 16.5,21.62 16.62,21.5 16.62,20.88 17.5,20 17.5,15.38 17.38,15.25 17.38,12.12 v16.5,11.25 | v38.88,9.88 39.75,9 v39.75,2
TX1  (via drill 0.3)
  Top 0.152: v18.38,27.12 19.12,27.88 19.88,27.88 R4.1 | D3.58 21.25,25.12 v21,24.88
  Route2 0.152: v17.75,8.38 18.5,8.38 19.88,7 20.88,7 X13.4 | v21,24.88 20.5,25.38 v18.38,25.38
  Route15 0.152: v17.75,8.38 17.75,15.12 17.88,15.25 17.88,20.12 17,21 17,21.5 18.62,23.12 18.62,25.38 | 18.62,25.38 18.62,26.88 v18.38,27.12 | 18.62,25.38 v18.38,25.38
TX2  (via drill 0.3)
  Top 0.152: v32.25,20.12 31.62,20.12 D3.16
  Route2 0.152: v32.25,20.12 24.62,20.12 23,18.5 v22.38,18.5
  Route15 0.152: v22.38,18.5 22.5,18.38 22.5,9.62 22.25,9.38 22.25,6.75 21,5.5 21,4.5 X17.4
TX3  (via drill 0.3)
  Top 0.152: v32.5,27.88 32.75,28.12 D3.29 | v36.75,26.12 35.62,26.12 R6.1
  Route2 0.152: v26.88,2.75 26,1.88 21,1.88 X12.4 | v26.62,9.88 27.38,9.12 34.75,9.12 v35.5,9.88 | v36.75,26.12 36.62,26.25 35.12,26.25 34,27.38 33,27.38 v32.5,27.88
  Route15 0.152: v26.88,2.75 26.88,9.62 v26.62,9.88 | v35.5,9.88 35.25,10.12 35.25,13.62 34.25,14.62 34.25,20.75 33.75,21.25 33.75,26.62 v32.5,27.88
TX4  (via drill 0.3)
  Top 0.152: v29.75,29.25 28.5,29.25 28.25,29 25.88,29 25.12,29.75 25.12,29.88 24.62,30.38 23.75,30.38 23.62,30.5 22,30.5 21.62,30.12 21.5,30.12 21,29.62 21,29.12 21.5,28.62 D3.51
  Route2 0.152: v39.12,7 37.5,7 X15.4 | v40,31.75 39.5,32.25 35.62,32.25 34.5,33.38 34,33.38 32.88,32.25 v32.88,32.12 | v29.75,29.25 v30.62,29.25
  Route15 0.152: v39.12,7 38.88,7.25 38.88,7.5 38.25,8.12 38.25,10.38 38.12,10.5 38.12,13.25 38.62,13.75 38.62,15 39,15.38 39,22.88 40,23.88 v40,31.75
  Bottom 0.152: v32.88,32.12 32.88,30.75 31.38,29.25 v30.62,29.25
TX5  (via drill 0.3)
  Top 0.152: D3.53 21.5,27.62 20.75,28.38 20.75,28.5 20.5,28.75 v19,28.75
  Route2 0.152: v18.38,14.25 18.5,14.12 30.5,14.12 31.62,13 37,13 v38,14
  Route15 0.152: v19,28.75 19,23 18.38,22.38 18.38,21.62 18.5,21.5 18.5,21 18.25,20.75 18.25,15.25 18.38,15.12 v18.38,14.25 | v38,14 37.75,13.75 37.75,10.38 37.88,10.25 37.88,8 38.5,7.38 38.5,6.62 37.5,5.62 37.5,4.5 X11.4
USBDM
  Top 0.254: D3.44 26.12,38.12 25.75,38.5 11.12,38.5 10.62,39 | 10.75,39.25 10.62,39 | 10.62,39 R185.2
USBDP
  Top 0.254: D3.45 25.62,37.62 25.25,38 10.88,38 10.5,37.75 R184.2
VBUS  (via drill 0.3)
  Top 0.152: R1.1 10,22.75 10.62,22.12 10.62,21.12 R19.2 10.75,21.12 10.62,21 10.5,21.12 v9.62,21.12 | D3.42 27.12,30.62 v26.12,29.62
  Route2 0.152: v24.5,29.62 v26.12,29.62 | v23.5,19.88 23.25,20.12 15.38,20.12 14.75,20.75 14.25,20.75 13.88,21.12 v9.62,21.12
  Route15 0.152: v24.5,29.62 24.75,29.38 24.75,24 24.25,23.5 24.25,20.62 v23.5,19.88
VCC  (via drill 0.3)
  Top 0.152: D1.13 11.38,45.75 11.12,46 10.25,46 C5.1 10.25,45.62 v10.75,45.12 | 37.12,15.68 D2.5 37.12,15.75 36.88,15.75 v36.25,16.38 36,16.62 34.5,16.62 C6.1 34.38,16.62 33,16.62 | R6.2 35.62,23.62 35.38,23.38 C15.1 35.5,23.25 35.62,23.25 v36.25,22.62 | 33,16.62 32.88,16.62 32.75,16.75 L2.2 33,16.62 | D3.32 33.62,29.62 v34.38,30.38 34.88,30.88 35.62,30.88 C13.1 | 33,16.62 32.88,16.5 32.75,16.62 31.88,15.75 30.38,15.75 30.25,15.88 30.25,16.88 29.88,17.25 28.88,17.25 28,16.38 27.88,16.38 R10.2 | V2.A 48.25,38.38 v47.38,37.5 | v23.25,22 23.25,22.12 | v11.25,32.62 11.12,32.5 11.12,31.75 C10.1 | v19.12,15.5 18,15.5 C2.1 | v19,22.12 19.07,22.12
  Top 0.254: D3.19 35.23,23.12 C15.1 | 19.07,22.12 D3.64 23.25,22.12 23.75,22.12 24.12,21.75 D3.1 | D3.48 22.23,31.57 C1.1 22.15,31.27 21.5,30.62 19.88,30.62 | 15.25,24.62 15.24,24.64 14.12,24.64 14,24.75 | 19.88,30.62 18.5,30.62 18.12,31 | 18.12,31 15.62,31 15.25,30.62 15.25,29.16 D4.7 D4.8 13.97,28.5 14,28.5 14,28.38 D7.13 11.62,28.38 11.38,28.62 11.38,29.75 | C10.1 11.38,31.4 D7.2 11.38,29.75 | 11.38,29.75 10.5,29.75 10.38,29.88 D7.4 | 18.12,31 18.12,33.52 R17.2 | R7.2 R5.2 17.52,15.3 17.38,15.45 | V6.A V4.A V2.A | R4.2 19.88,30.62
  Top 0.406: D5.5 17.38,15.45 17.8,15.45 C2.1 | C41.1 16.5,20.61 D4.3 16.5,24.62 | 16.5,24.62 18.62,24.62 19.07,24.18 19.07,22.12 19.07,21.23 C11.1 | 16.5,24.62 15.25,24.62 12.19,24.62 R159.2 | 14,24.75 14,29.12 D4.8 14,29.18 14,31.75 13.85,31.9 C9.1 13.85,33.62 D6.2 D6.1 12.62,33.75 12.5,33.88 10.53,33.88 R16.2
  Route2 0.152: v34.62,37.5 v47.38,37.5 | v27.38,2 27.5,1.88 29.75,1.88 X16.1 | v36.25,16.38 36,16.62 25.38,16.62 v24.88,17.12
  Route15 0.152: v36.25,16.38 v36.25,22.62 35.88,23 35.88,28.25 35.75,28.38 35.75,29 | 35.75,29 v34.38,30.38 | v34.62,37.5 35.75,36.38 35.75,29 | v27.38,2 27.5,2.12 27.5,3 27.25,3.25 27.25,12.12 24.62,14.75 24.62,17.12 | 24.62,17.12 24.62,17.62 22.88,19.38 22.88,21.62 v23.25,22 | v10.75,45.12 11.38,44.5 11.38,35.25 11.25,35.12 v11.25,32.62 | v19.12,15.5 18.62,16 18.62,20.62 18.88,20.88 18.88,22 v19,22.12 | 24.62,17.12 v24.88,17.12
VCCEXT  (via drill 0.6)
  Top 0.406: C19.1 31.52,14.25 31.5,14.25 31,13.75 31,13.12 30.48,12.61 D8.5 30.48,12.02 v30.5,11.88 | v11.5,1.88 v11.5,7.04 v11.5,4.46 11.5,1.12 12,0.62 27.62,0.62 28.12,1.12 v28.12,4.38 v28.12,7
  Bottom 0.406: SJ13.1 11.48,4.45 v11.5,4.46 | 11.43,1.91 11.35,1.91 | 11.35,1.91 v11.5,1.88 | SJ1.1 11.45,6.99 v11.5,7.04 | SJ2.1 11.35,1.91 | SJ12.1 27.86,6.99 v28.12,7 28.12,11.38 28.62,11.88 v30.5,11.88 | v28.12,4.38 26.99,4.38 SJ3.1

### Text on the board
Top: Copyright 2012 - 2013 by Quantec Networks GmbH / http://www.quantec-networks.de/quanton/ / Licensed under CC-BY-SA-NC